# EasyEDA Pro project ProPrj_超级电容V1.1-正式版.epro, schematic Schematic1, sheets 4 to 8 of 8

## Sheets
4 功率控制: Page Name: 功率控制; Update Date: 2024-04-19
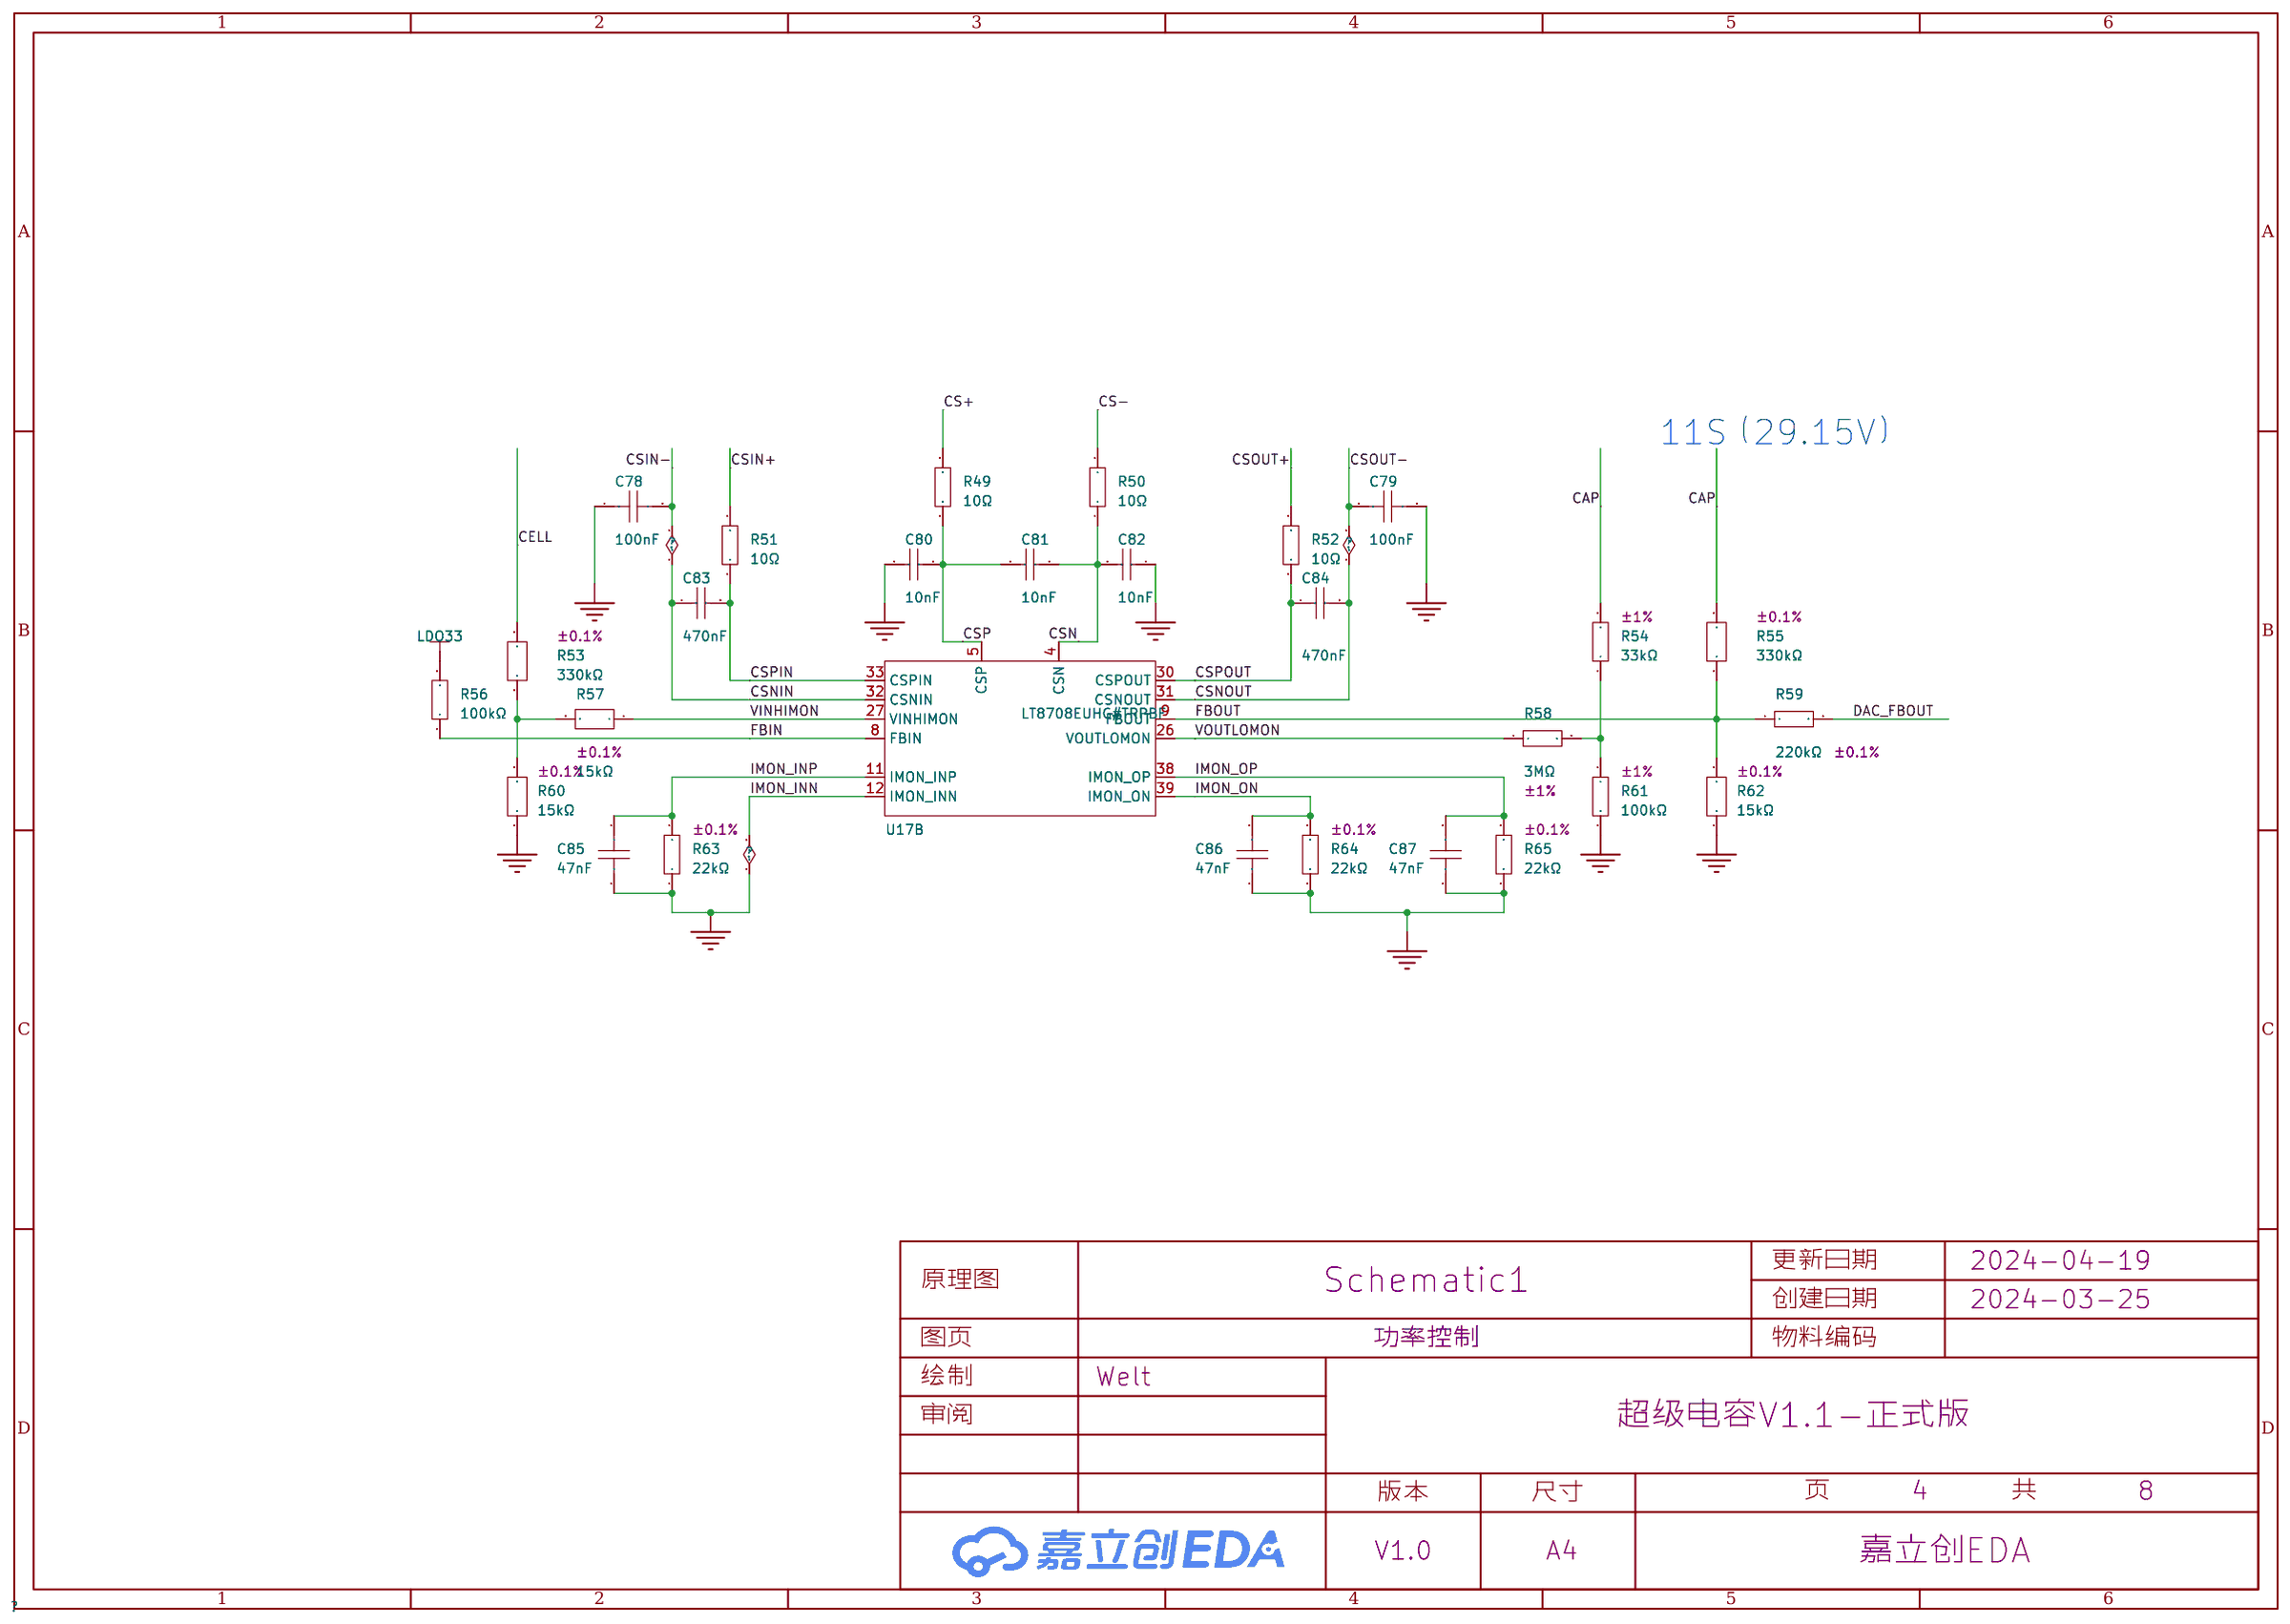
[diagram p3: 功率控制]
5 采样: Page Name: 采样; Update Date: 2024-04-19
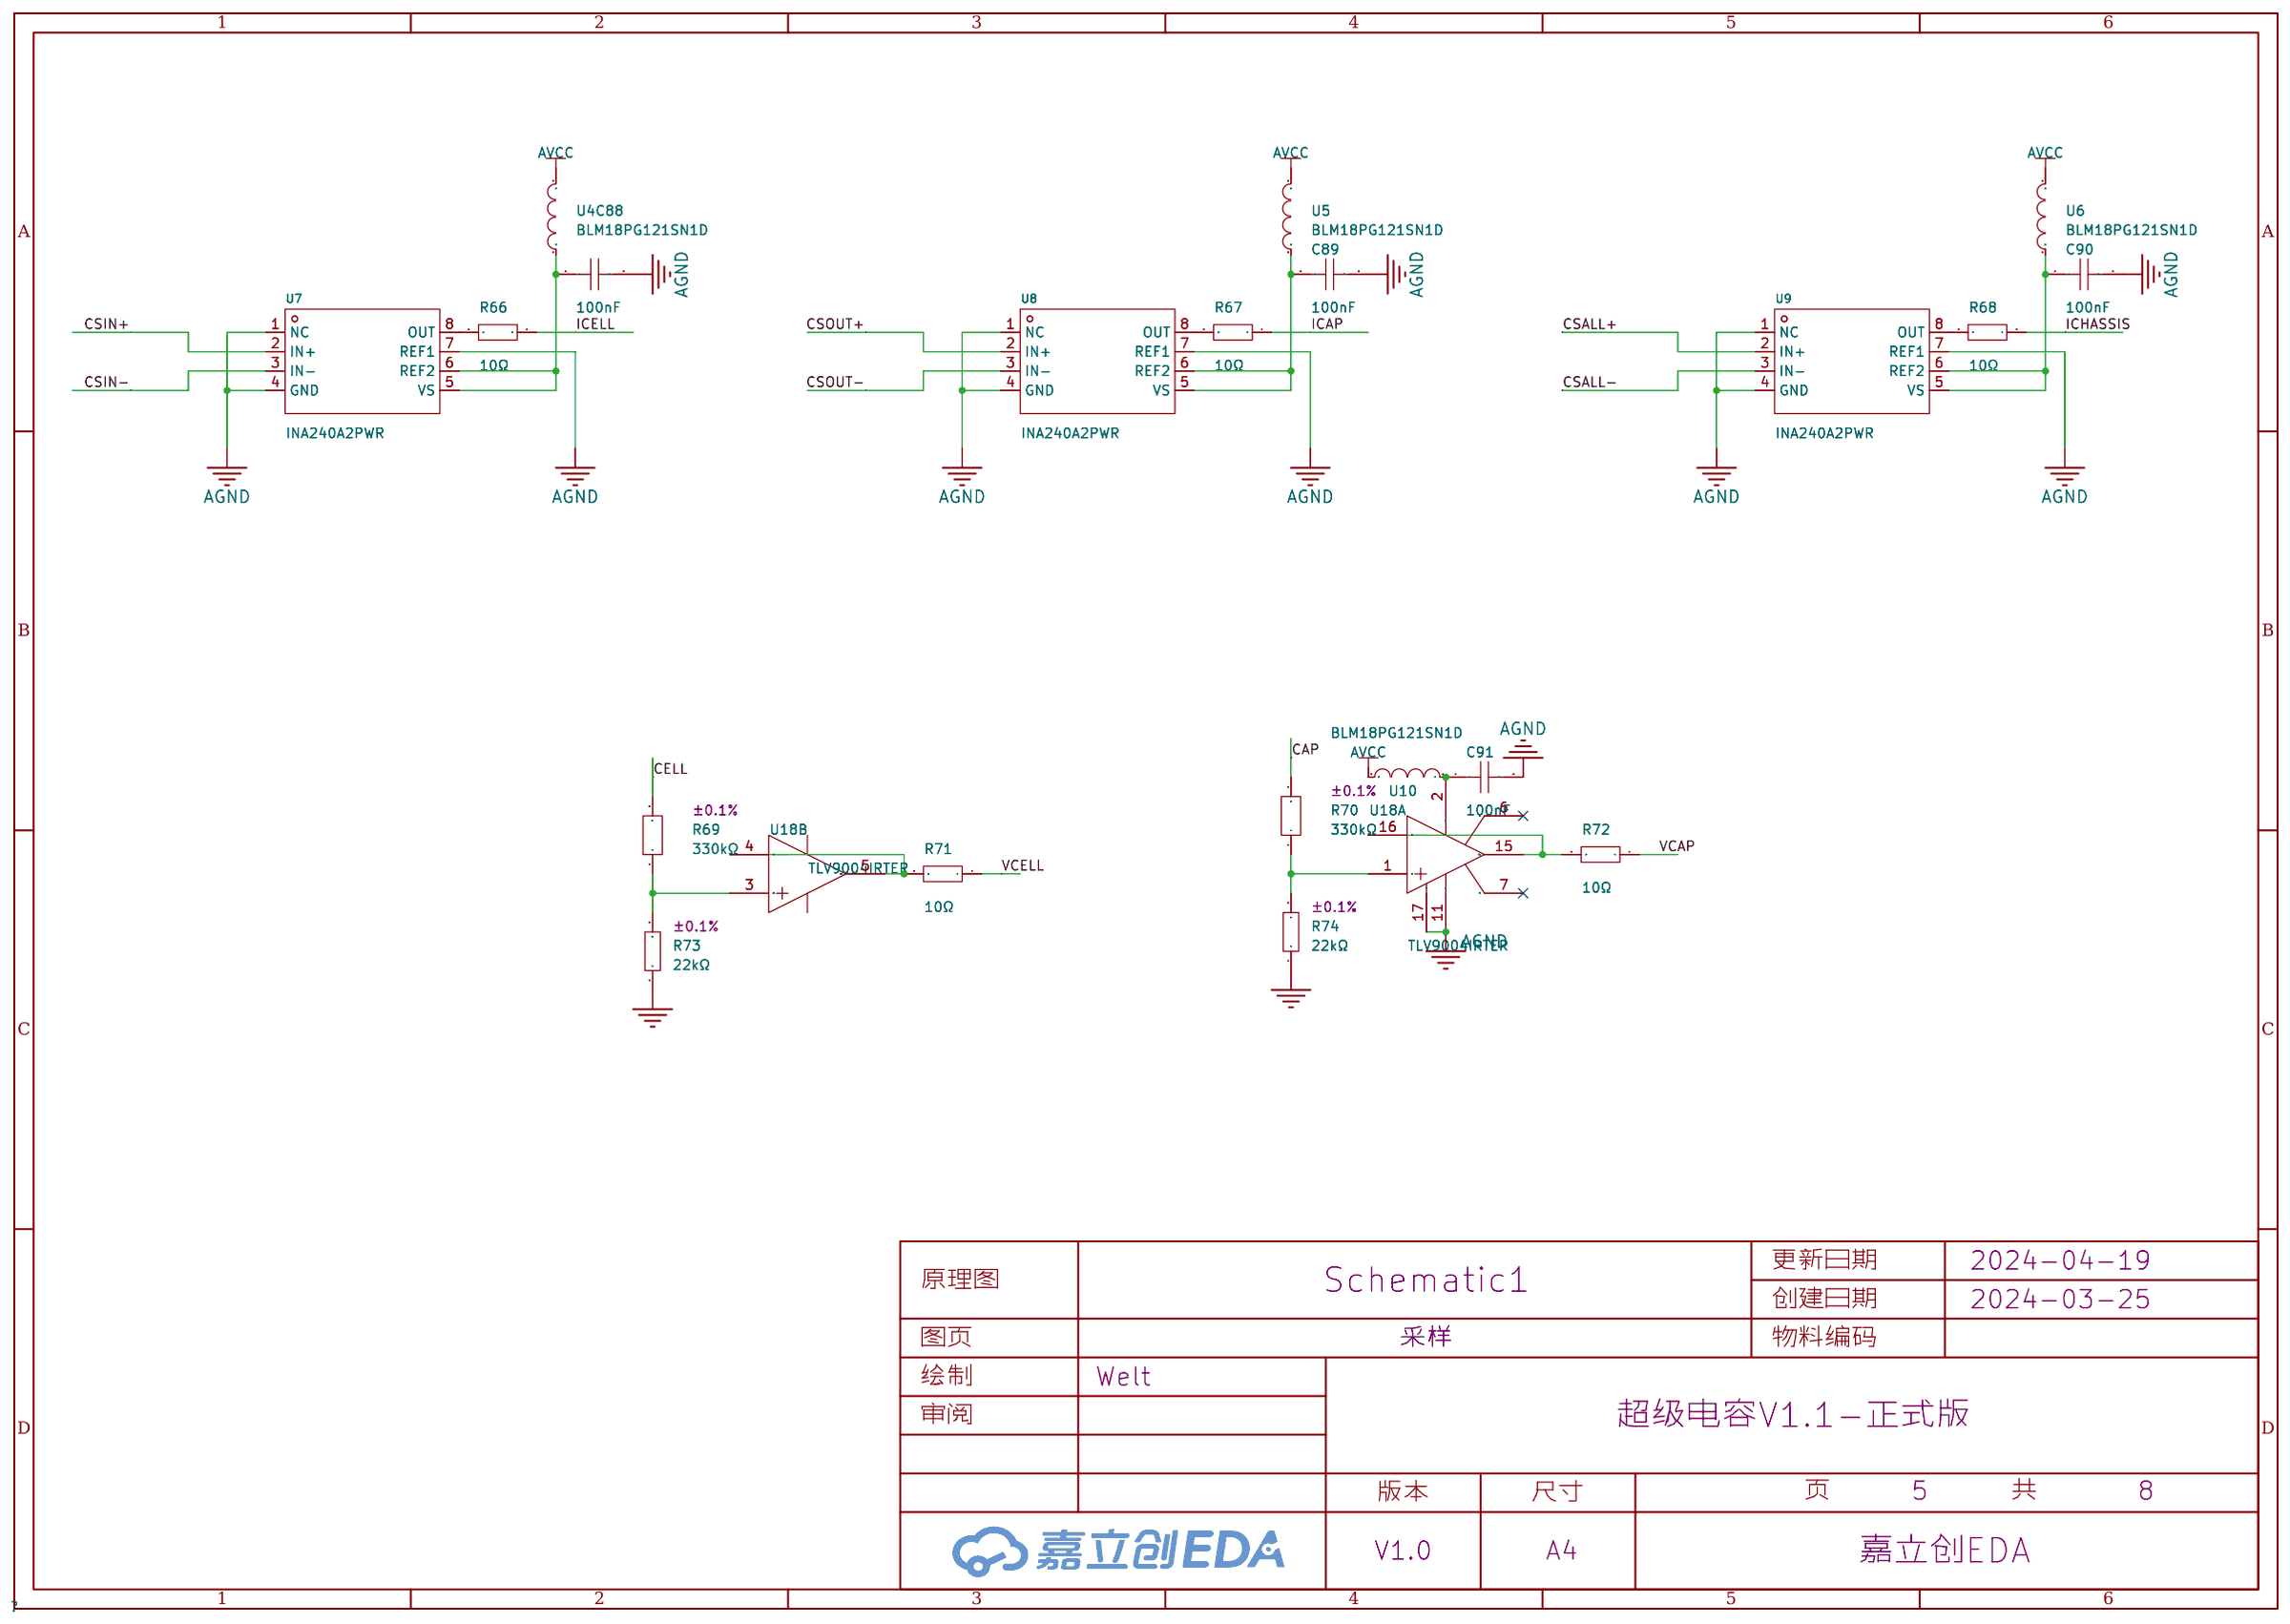
[diagram p4: 采样]
6 DAC: Page Name: DAC; Project Name: 超级电容V1.0-样板; Update Date: 2024-04-19
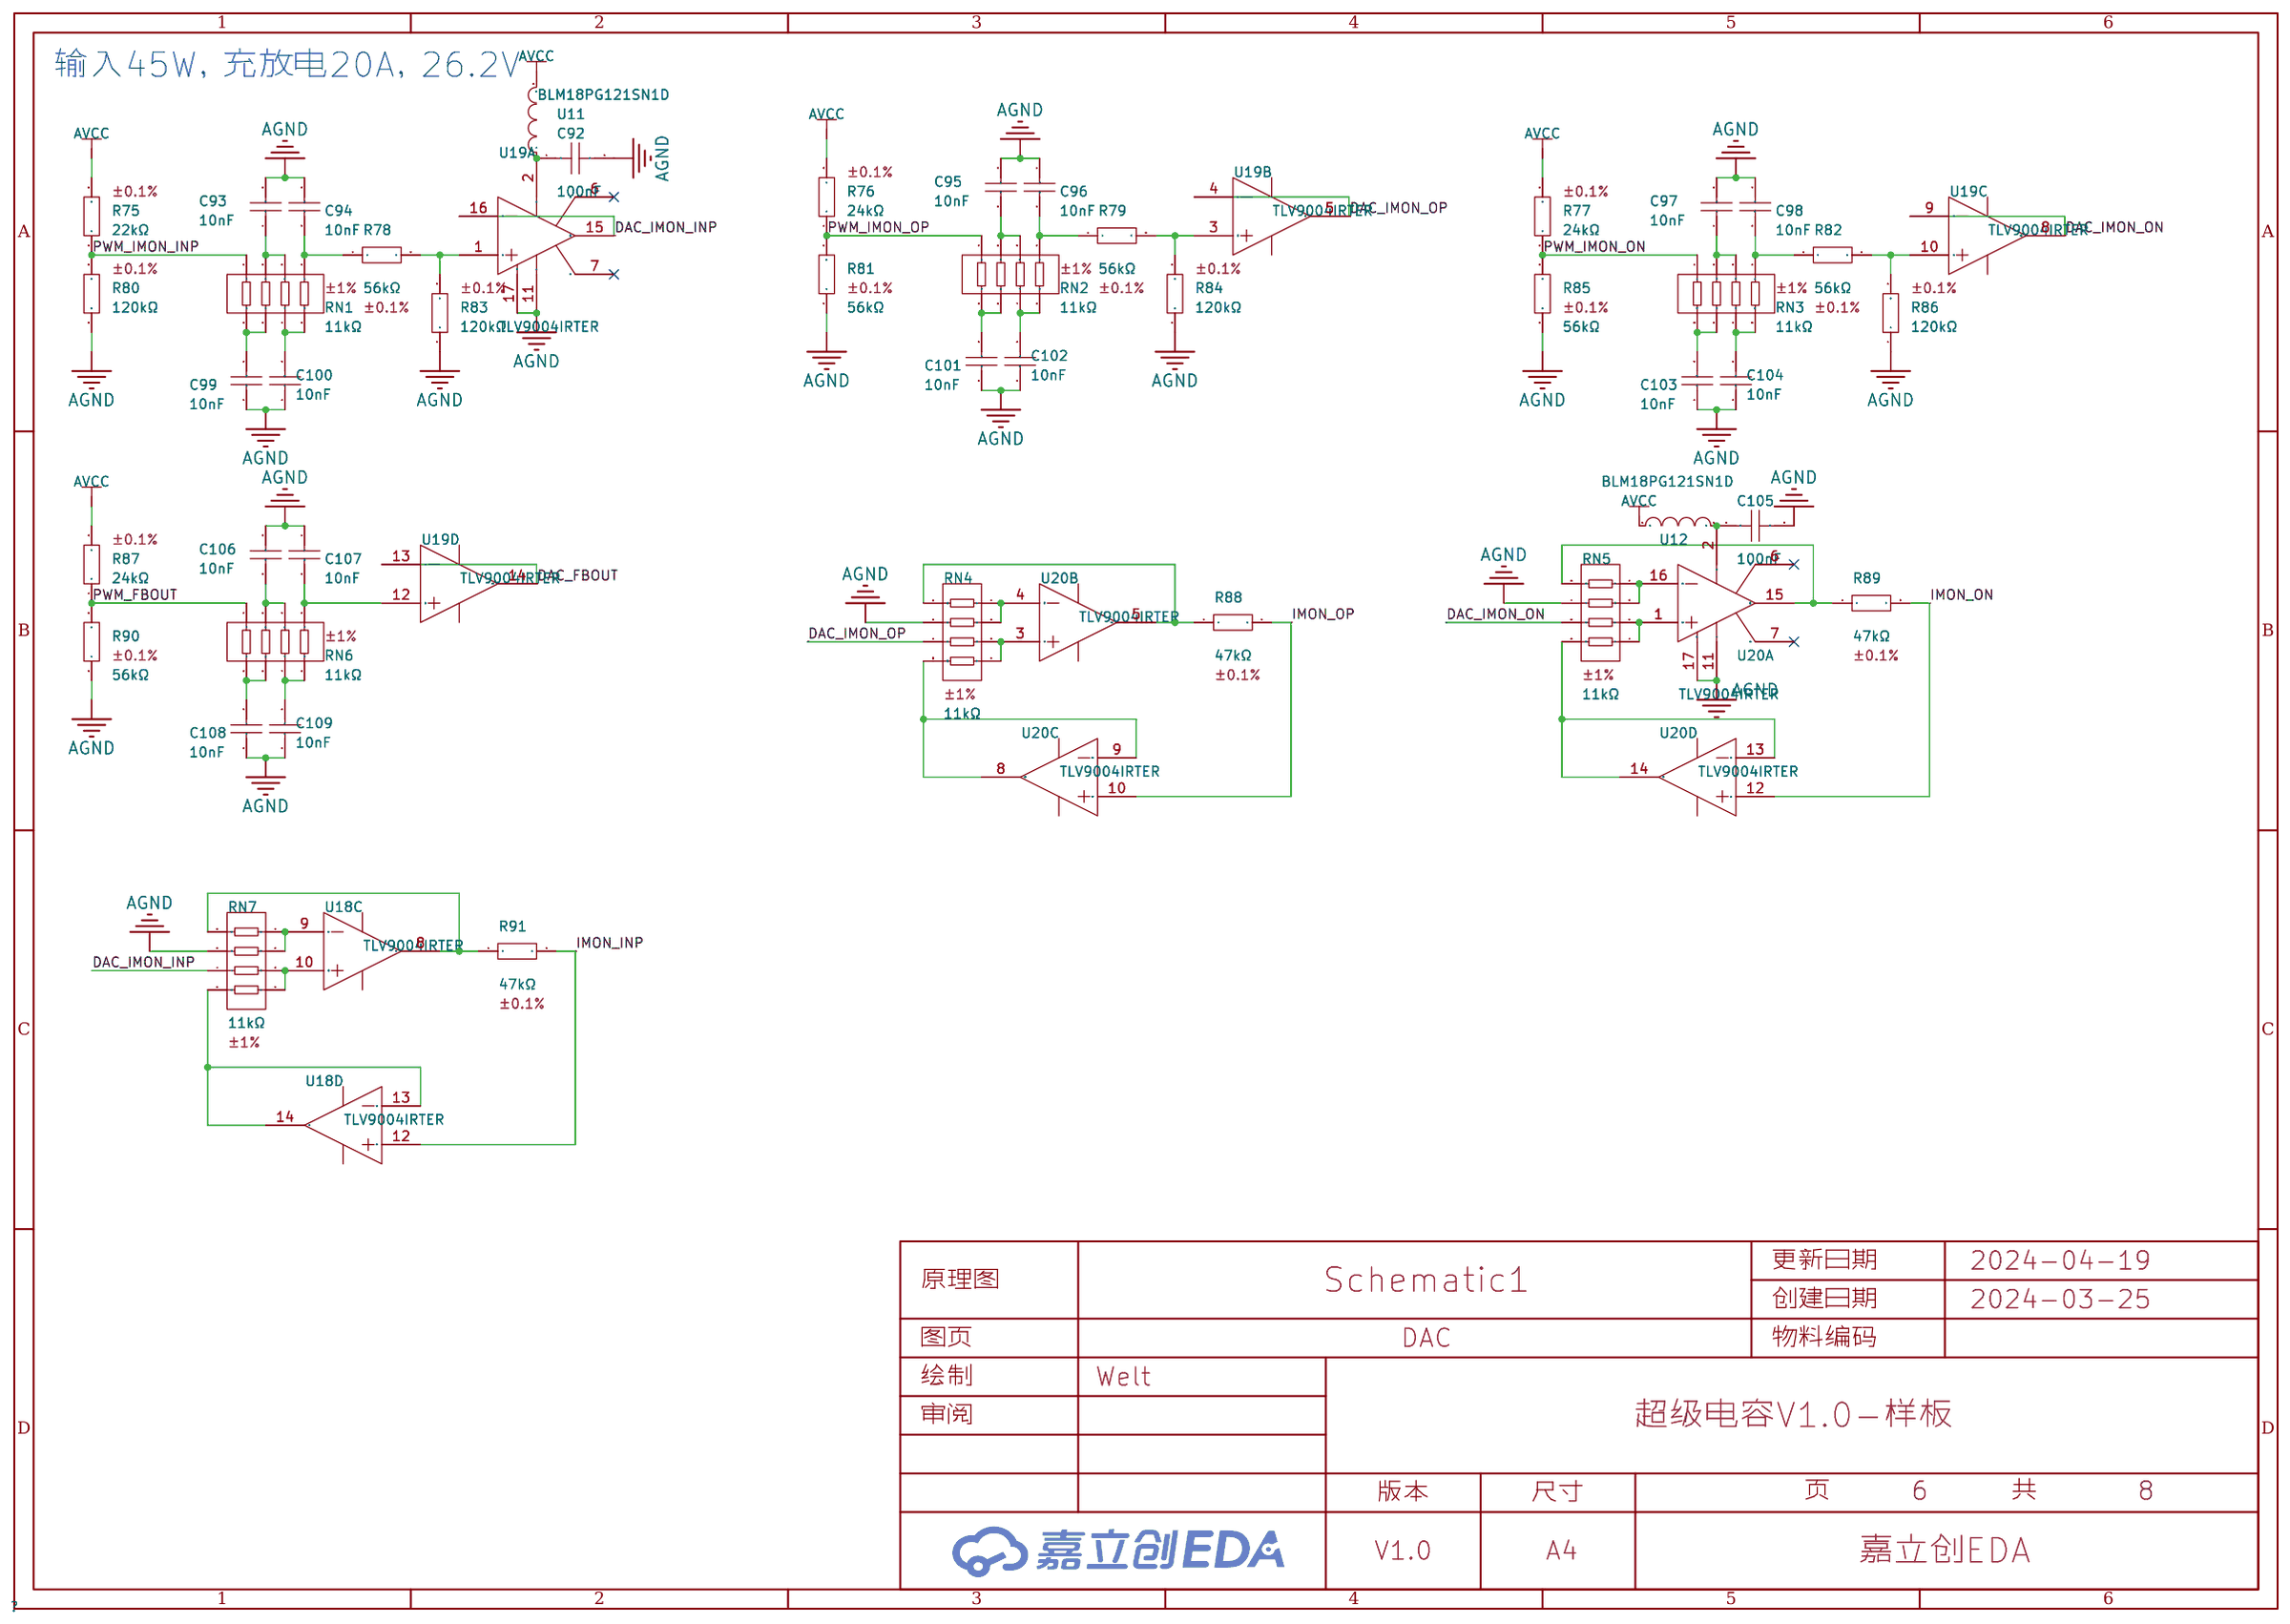
[diagram p5: DAC]
7 数字区: Page Name: 数字区; Project Name: 超级电容V1.0-样板
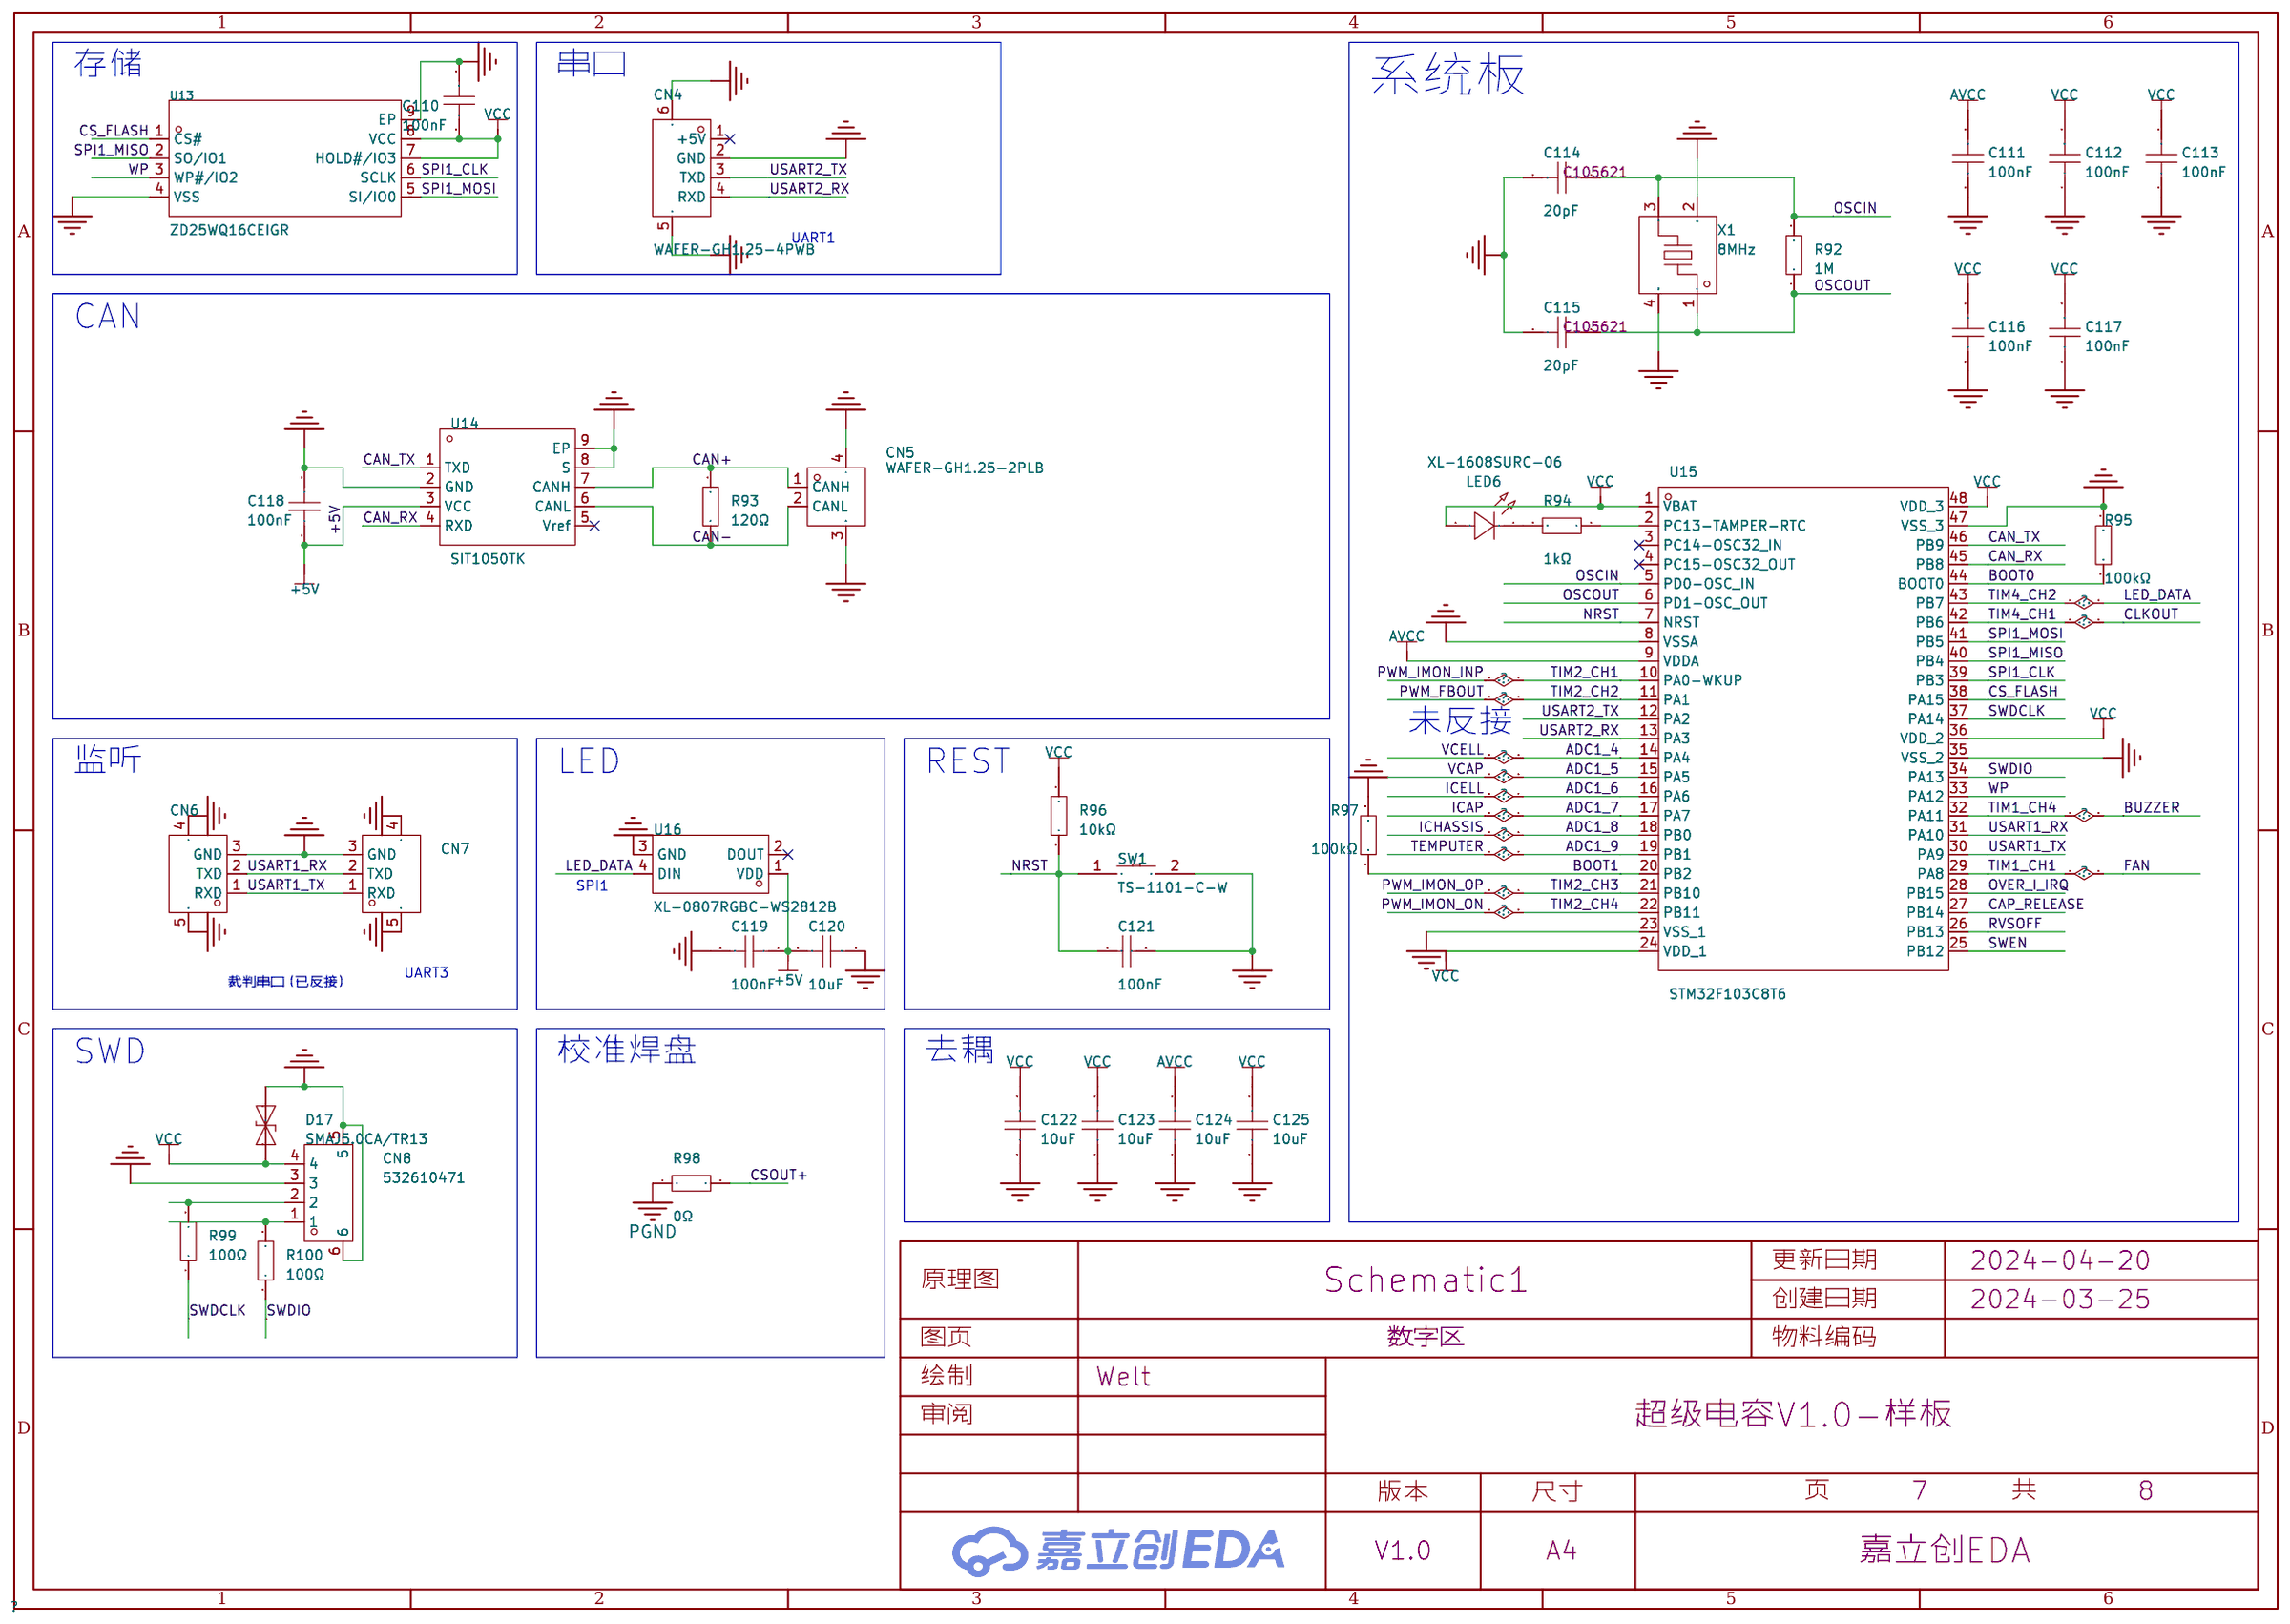
[diagram p6: 数字区]
8 保护: Page Name: 保护; Update Date: 2024-04-24
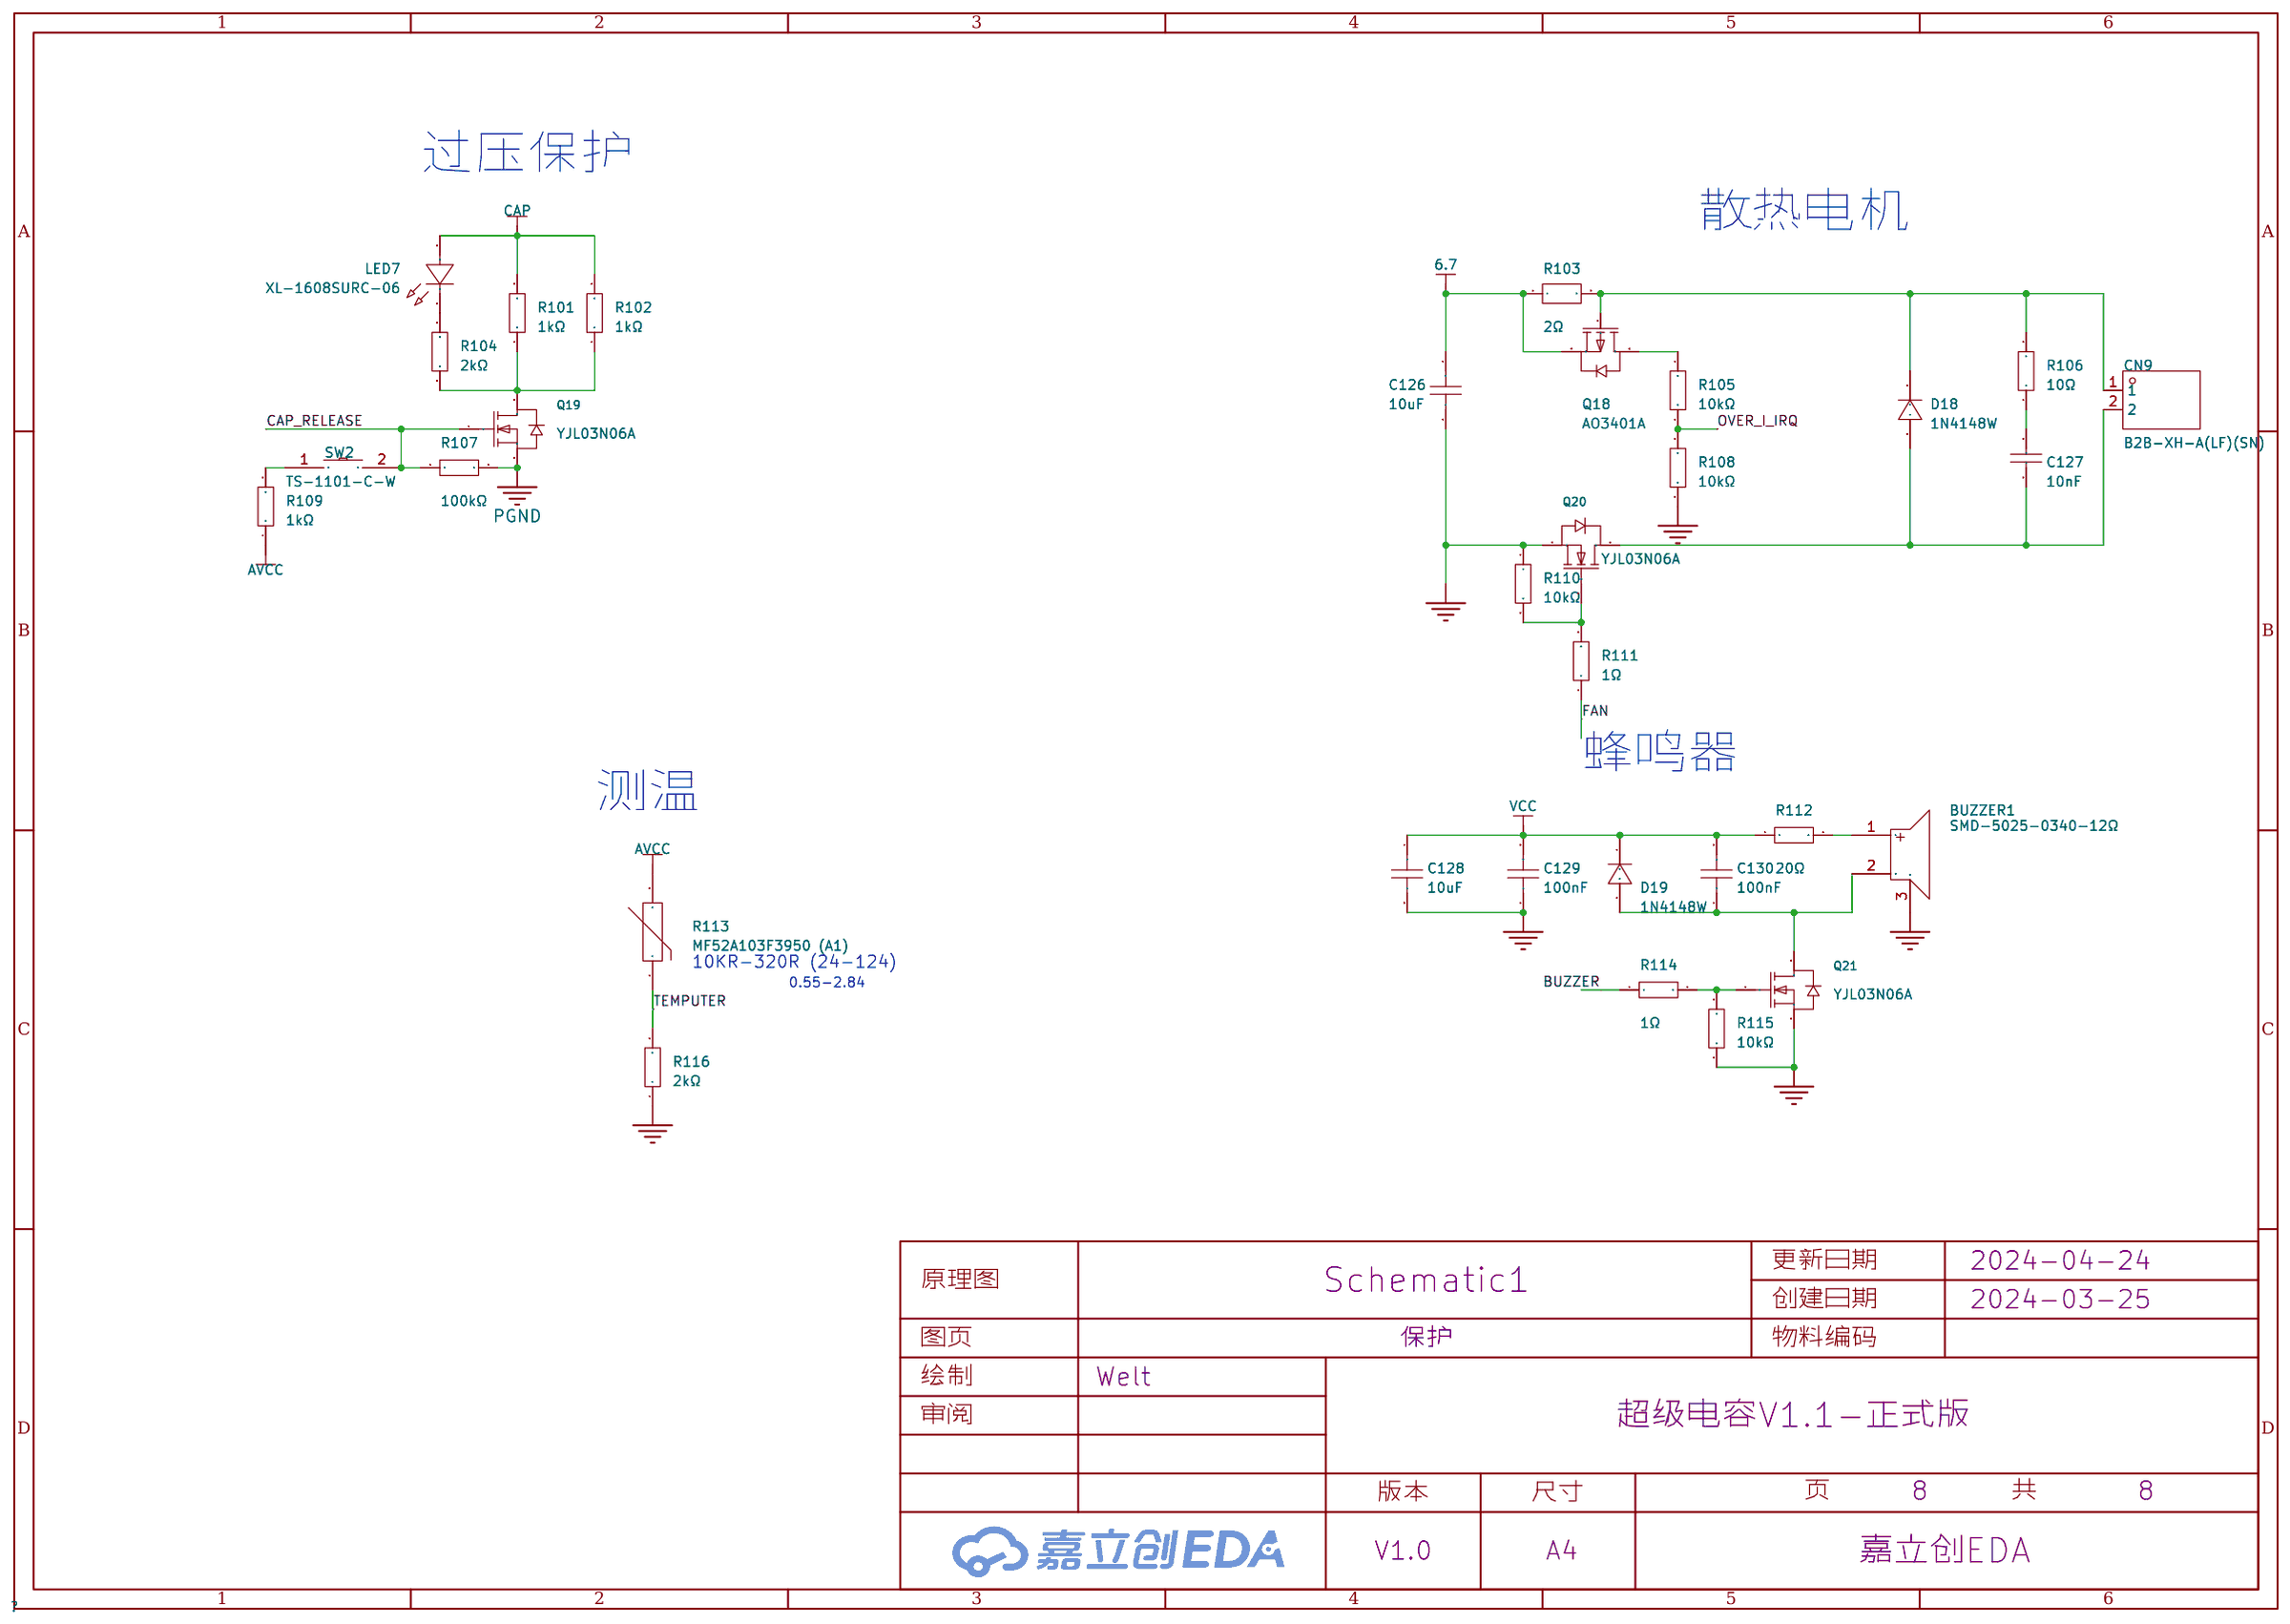
[diagram p7: 保护]

## Parts
sheet 8708核心区
U17  LT8708EUHG#TRPBF  [QFN-40_LT8708_Test]  (sections Center,Control,Power)
sheet DAC
C92  100nF  [0603电容-简化]
C93  10nF  [0603电容-简化]
C94  10nF  [0603电容-简化]
C95  10nF  [0603电容-简化]
C96  10nF  [0603电容-简化]
C97  10nF  [0603电容-简化]
C98  10nF  [0603电容-简化]
C99  10nF  [0603电容-简化]
C100  10nF  [0603电容-简化]
C101  10nF  [0603电容-简化]
C102  10nF  [0603电容-简化]
C103  10nF  [0603电容-简化]
C104  10nF  [0603电容-简化]
C105  100nF  [0603电容-简化]
C106  10nF  [0603电容-简化]
C107  10nF  [0603电容-简化]
C108  10nF  [0603电容-简化]
C109  10nF  [0603电容-简化]
R75  22kΩ  [0603电阻-简化]
R76  24kΩ  [0603电阻-简化]
R77  24kΩ  [0603电阻-简化]
R78  56kΩ  [0603电阻-简化]
R79  56kΩ  [0603电阻-简化]
R80  120kΩ  [0603电阻-简化]
R81  56kΩ  [0603电阻-简化]
R82  56kΩ  [0603电阻-简化]
R83  120kΩ  [0603电阻-简化]
R84  120kΩ  [0603电阻-简化]
R85  56kΩ  [0603电阻-简化]
R86  120kΩ  [0603电阻-简化]
R87  24kΩ  [0603电阻-简化]
R88  47kΩ  [0603电阻-简化]
R89  47kΩ  [0603电阻-简化]
R90  56kΩ  [0603电阻-简化]
R91  47kΩ  [0603电阻-简化]
RN1  11kΩ  [RES-ARRAY-SMD_0603-8P-L3.2-W1.6-BL]
RN2  11kΩ  [RES-ARRAY-SMD_0603-8P-L3.2-W1.6-BL]
RN3  11kΩ  [RES-ARRAY-SMD_0603-8P-L3.2-W1.6-BL]
RN4  11kΩ  [RES-ARRAY-SMD_0603-8P-L3.2-W1.6-BL]
RN5  11kΩ  [RES-ARRAY-SMD_0603-8P-L3.2-W1.6-BL]
RN6  11kΩ  [RES-ARRAY-SMD_0603-8P-L3.2-W1.6-BL]
RN7  11kΩ  [RES-ARRAY-SMD_0603-8P-L3.2-W1.6-BL]
U11  BLM18PG121SN1D  [0603磁珠-简化]
U12  BLM18PG121SN1D  [0603磁珠-简化]
U19  TLV9004IRTER  [WQFN-16_L3.0-W3.0-P0.50-TL-EP1.7]  (sections 1,2,3,4)
U20  TLV9004IRTER  [WQFN-16_L3.0-W3.0-P0.50-TL-EP1.7]  (sections 1,2,3,4)
sheet 保护
BUZZER1  SMD-5025-0340-12Ω  [BUZ-SMD_3P-L5.0-W5.0-BL]
C126  10uF  [0805电容-简化]
C127  10nF  [0603电容-简化]
C128  10uF  [0805电容-简化]
C129  100nF  [0603电容-简化]
C130  100nF  [0603电容-简化]
CN9  B2B-XH-A(LF)(SN)  [CONN-TH_B2B-XH-A-LF-SN]
D18  1N4148W  [SOD-123_L2.8-W1.8-LS3.7-RD]
D19  1N4148W  [SOD-123_L2.8-W1.8-LS3.7-RD]
LED7  XL-1608SURC-06  [LED0603-RD_RED]
Q18  AO3401A  [SOT-23_L2.9-W1.3-P1.90-LS2.4-BR]
Q19  YJL03N06A  [SOT-23-3_L2.9-W1.3-P1.90-LS2.4-BR]
Q20  YJL03N06A  [SOT-23-3_L2.9-W1.3-P1.90-LS2.4-BR]
Q21  YJL03N06A  [SOT-23-3_L2.9-W1.3-P1.90-LS2.4-BR]
R101  1kΩ  [R2512]
R102  1kΩ  [R2512]
R103  2Ω  [R2512]
R104  2kΩ  [0603电阻-简化]
R105  10kΩ  [0603电阻-简化]
R106  10Ω  [0603电阻-简化]
R107  100kΩ  [0603电阻-简化]
R108  10kΩ  [0603电阻-简化]
R109  1kΩ  [0603电阻-简化]
R110  10kΩ  [0603电阻-简化]
R111  1Ω  [0603电阻-简化]
R112  20Ω  [0603电阻-简化]
R113  MF52A103F3950 (A1)  [RES-TH_L2.5-W2.5-P1.70-D0.3]
R114  1Ω  [0603电阻-简化]
R115  10kΩ  [0603电阻-简化]
R116  2kΩ  [0603电阻-简化]
SW2  TS-1101-C-W  [SW-SMD_L6.0-W3.3-LS8.0]
sheet 功率控制
C78  100nF  [0603电容-简化]
C79  100nF  [0603电容-简化]
C80  10nF  [0603电容-简化]
C81  10nF  [0603电容-简化]
C82  10nF  [0603电容-简化]
C83  470nF  [0603电容-简化]
C84  470nF  [0603电容-简化]
C85  47nF  [0603电容-简化]
C86  47nF  [0603电容-简化]
C87  47nF  [0603电容-简化]
R49  10Ω  [0603电阻-简化]
R50  10Ω  [0603电阻-简化]
R51  10Ω  [0603电阻-简化]
R52  10Ω  [0603电阻-简化]
R53  330kΩ  [0603电阻-简化]
R54  33kΩ  [0603电阻-简化]
R55  330kΩ  [0603电阻-简化]
R56  100kΩ  [0603电阻-简化]
R57  15kΩ  [0603电阻-简化]
R58  3MΩ  [0603电阻-简化]
R59  220kΩ  [0603电阻-简化]
R60  15kΩ  [0603电阻-简化]
R61  100kΩ  [0603电阻-简化]
R62  15kΩ  [0603电阻-简化]
R63  22kΩ  [0603电阻-简化]
R64  22kΩ  [0603电阻-简化]
R65  22kΩ  [0603电阻-简化]
sheet 数字区
C110  100nF  [0603电容-简化]
C111  100nF  [0603电容-简化]
C112  100nF  [0603电容-简化]
C113  100nF  [0603电容-简化]
C114  20pF  [0603电容-简化]
C115  20pF  [0603电容-简化]
C116  100nF  [0603电容-简化]
C117  100nF  [0603电容-简化]
C118  100nF  [0603电容-简化]
C119  100nF  [0603电容-简化]
C120  10uF  [0805电容-简化]
C121  100nF  [0603电容-简化]
C122  10uF  [0805电容-简化]
C123  10uF  [0805电容-简化]
C124  10uF  [0805电容-简化]
C125  10uF  [0805电容-简化]
CN4  WAFER-GH1.25-4PWB  [CONN-SMD_4P-P1.25_XUNPU_WAFER-GH1.25-4PWB]
CN5  WAFER-GH1.25-2PLB  [CONN-TH_2P-P1.25_XUNPU_WAFER-GH1.25-2PLB]
CN6  WAFER-GH1.25-3PLB  [CONN-SMD_3P-P1.25_XUNPU_WAFER-GH1.25-3PLB]
CN7  WAFER-GH1.25-3PLB  [CONN-SMD_3P-P1.25_XUNPU_WAFER-GH1.25-3PLB]
CN8  532610471  [CONN-SMD_4P-P1.25_53261-0471]
D17  SMAJ5.0CA/TR13  [SMA_L4.4-W2.6-LS5.0-BI]
LED6  XL-1608SURC-06  [LED0603-RD_RED]
R92  1M  [0603电阻-简化]
R93  120Ω  [0603电阻-简化]
R94  1kΩ  [0603电阻-简化]
R95  100kΩ  [0603电阻-简化]
R96  10kΩ  [0603电阻-简化]
R97  100kΩ  [0603电阻-简化]
R98  0Ω  [R0402]
R99  100Ω  [0603电阻-简化]
R100  100Ω  [0603电阻-简化]
SW1  TS-1101-C-W  [SW-SMD_L6.0-W3.3-LS8.0]
U13  ZD25WQ16CEIGR  [USON-8_L3.0-W2.0-P0.50-BL-EP]
U14  SIT1050TK  [TDFN-8_L3.0-W3.0-P0.65-BL-EP]
U15  STM32F103C8T6  [LQFP-48_L7.0-W7.0-P0.50-LS9.0-BL]
U16  XL-0807RGBC-WS2812B  [LED-SMD_4P-L2.0-W1.8_CY-0807]
X1  8MHz  [CRYSTAL-SMD_4P-L3.2-W2.5-BL-1]
sheet 采样
C88  100nF  [0603电容-简化]
C89  100nF  [0603电容-简化]
C90  100nF  [0603电容-简化]
C91  100nF  [0603电容-简化]
R66  10Ω  [0603电阻-简化]
R67  10Ω  [0603电阻-简化]
R68  10Ω  [0603电阻-简化]
R69  330kΩ  [0603电阻-简化]
R70  330kΩ  [0603电阻-简化]
R71  10Ω  [0603电阻-简化]
R72  10Ω  [0603电阻-简化]
R73  22kΩ  [0603电阻-简化]
R74  22kΩ  [0603电阻-简化]
U4  BLM18PG121SN1D  [0603磁珠-简化]
U5  BLM18PG121SN1D  [0603磁珠-简化]
U6  BLM18PG121SN1D  [0603磁珠-简化]
U7  INA240A2PWR  [TSSOP-8_L4.4-W3.0-P0.65-LS6.4-BL]
U8  INA240A2PWR  [TSSOP-8_L4.4-W3.0-P0.65-LS6.4-BL]
U9  INA240A2PWR  [TSSOP-8_L4.4-W3.0-P0.65-LS6.4-BL]
U10  BLM18PG121SN1D  [0603磁珠-简化]
U18  TLV9004IRTER  [WQFN-16_L3.0-W3.0-P0.50-TL-EP1.7]  (sections 1,2,3,4)

## Library data of the parts
U17 = LT8708EUHG#TRPBF: 功能类型:升降压型;同步整流:是;输出通道数:1;拓扑结构:升降压式;输入电压:2.8V~80V;开关频率:400kHz;占空比(最大值):80%;工作温度:-40℃~+125℃;; LCSC Part Name: 升降压型 2.8V~80V 400kHz; Supplier Part: C2658801; Manufacturer: ADI(亚德诺)/LINEAR; Supplier Footprint: QFN-40(5x8); JLCPCB Part Class: 扩展库; Datasheet: https://atta.szlcsc.com/upload/public/pdf/source/20210601/0A4036ACA6D5292E858C905D6C703EE3.pdf; Supplier: LCSC; Function: 升降压型; Synchronous Rectification: 是; Number of Outputs: 1; Topology: 升降压式; Input Voltage: 2.8V~80V; Switching Frequency: 400kHz; Duty Cycle (Max): 80%; Operating Temperature: -40℃~+125℃; Check: false
C78 C79 C88-C92 C105 C129 C130 = CC0603KRX7R9BB104: 容值:100nF;精度:±10%;额定电压:50V;材质(温度系数):X7R;; LCSC Part Name: 100nF ±10% 50V; Supplier Part: C14663; Manufacturer: YAGEO(国巨); Supplier Footprint: 0603; JLCPCB Part Class: 基础库; Datasheet: https://atta.szlcsc.com/upload/public/pdf/source/20180910/C282072_33301C7F631E79921B82A8DAC6BCC5B3.pdf; Supplier: LCSC; Tolerance: ±10%; Voltage Rated: 50V; Temperature Coefficient: X7R
C80-C82 C93-C104 C106-C109 C127 = CC0603KRX7R9BB103: 容值:10nF;精度:±10%;额定电压:50V;材质(温度系数):X7R;; LCSC Part Name: 10nF ±10% 50V; Supplier Part: C100042; Manufacturer: YAGEO(国巨); Supplier Footprint: 0603; JLCPCB Part Class: 扩展库; Datasheet: https://atta.szlcsc.com/upload/public/pdf/source/20180326/C100042_E8B0111D51DE3671A0A4A59FBCEFE81C.pdf; Supplier: LCSC; Tolerance: ±10%; Voltage Rated: 50V; Temperature Coefficient: X7R
R63-R65 R73-R75 = PTFR0603B22K0P9: 电阻类型:薄膜电阻;阻值:22kΩ;精度:±0.1%;功率:100mW;最大工作电压:100V;温度系数:±25ppm/℃;; LCSC Part Name: 薄膜电阻 22kΩ ±0.1% 100mW; Supplier Part: C351665; Manufacturer: RESI(开步睿思）; Supplier Footprint: 0603; JLCPCB Part Class: Extended Part; Datasheet: https://atta.szlcsc.com/upload/public/pdf/source/20231020/37F75D505DFC5CA75CC16B0F0ECD8764.pdf; Supplier: LCSC; Type: 薄膜电阻; Tolerance: ±0.1%; Power(Watts): 100mW; Overload Voltage (Max): 100V; Temperature Coefficient: ±25ppm/℃; Operating Temperature Range: -55℃~+125℃
R76 R77 R87 = PTFR0603B24K0P9: 电阻类型:薄膜电阻;阻值:24kΩ;精度:±0.1%;功率:100mW;最大工作电压:100V;温度系数:±25ppm/℃;; LCSC Part Name: 薄膜电阻 24kΩ ±0.1% 100mW; Supplier Part: C351663; Manufacturer: RESI(开步睿思）; Supplier Footprint: 0603; JLCPCB Part Class: Extended Part; Datasheet: https://atta.szlcsc.com/upload/public/pdf/source/20231020/37F75D505DFC5CA75CC16B0F0ECD8764.pdf; Supplier: LCSC; Type: 薄膜电阻; Tolerance: ±0.1%; Power(Watts): 100mW; Overload Voltage (Max): 100V; Temperature Coefficient: ±25ppm/℃; Operating Temperature Range: -55℃~+125℃
R78 R79 R81 R82 R85 R90 = PTFR0603B56K0P9: 电阻类型:薄膜电阻;阻值:56kΩ;精度:±0.1%;功率:100mW;最大工作电压:100V;温度系数:±25ppm/℃;; LCSC Part Name: 薄膜电阻 56kΩ ±0.1% 100mW; Supplier Part: C351640; Manufacturer: RESI(开步睿思）; Supplier Footprint: 0603; JLCPCB Part Class: Extended Part; Datasheet: https://atta.szlcsc.com/upload/public/pdf/source/20231020/37F75D505DFC5CA75CC16B0F0ECD8764.pdf; Supplier: LCSC; Type: 薄膜电阻; Tolerance: ±0.1%; Power(Watts): 100mW; Overload Voltage (Max): 100V; Temperature Coefficient: ±25ppm/℃; Operating Temperature Range: -55℃~+125℃
R80 R83 R84 R86 = PTFR0603B120KP9: 电阻类型:薄膜电阻;阻值:120kΩ;精度:±0.1%;功率:100mW;最大工作电压:100V;温度系数:±25ppm/℃;; LCSC Part Name: 薄膜电阻 120kΩ ±0.1% 100mW; Supplier Part: C351687; Manufacturer: RESI(开步睿思）; Supplier Footprint: 0603; JLCPCB Part Class: Extended Part; Datasheet: https://atta.szlcsc.com/upload/public/pdf/source/20231020/37F75D505DFC5CA75CC16B0F0ECD8764.pdf; Supplier: LCSC; Type: 薄膜电阻; Tolerance: ±0.1%; Power(Watts): 100mW; Overload Voltage (Max): 100V; Temperature Coefficient: ±25ppm/℃; Operating Temperature Range: -55℃~+125℃
R88 R89 R91 = PTFR0603B47K0P9: 电阻类型:薄膜电阻;阻值:47kΩ;精度:±0.1%;功率:100mW;最大工作电压:100V;温度系数:±25ppm/℃;; LCSC Part Name: 薄膜电阻 47kΩ ±0.1% 100mW; Supplier Part: C328427; Manufacturer: RESI(开步睿思）; Supplier Footprint: 0603; JLCPCB Part Class: Extended Part; Datasheet: https://atta.szlcsc.com/upload/public/pdf/source/20231020/37F75D505DFC5CA75CC16B0F0ECD8764.pdf; Supplier: LCSC; Type: 薄膜电阻; Tolerance: ±0.1%; Power(Watts): 100mW; Overload Voltage (Max): 100V; Temperature Coefficient: ±25ppm/℃; Operating Temperature Range: -55℃~+125℃
RN1-RN7 = 4D03WGF1102T5E: 阻值:11kΩ;精度:±1%;单个元件功率:62.5mW;电阻器数:4;温度系数:±200ppm/℃;; LCSC Part Name: 11kΩ ±1%; Supplier Part: C425236; Manufacturer: UNI-ROYAL(厚声); Supplier Footprint: 0603x4; JLCPCB Part Class: Extended Part; Datasheet: https://atta.szlcsc.com/upload/public/pdf/source/20191224/C474318_2527498AE30E813171187CCD28401A71.pdf; Supplier: LCSC; Tolerance: ±1%; Power(Watts): 62.5mW; Number of Resistors: 4; Temperature Coefficient: ±200ppm/℃; Number of Pins: 8
U4-U6 U10-U12 = BLM18PG121SN1D: 标称阻抗@测试频率:120Ω@100MHz;误差:±25%;直流电阻(RDC):50mΩ;额定电流:2A;电路数:1;; LCSC Part Name: 120Ω@100MHz ±25%; Supplier Part: C14709; Manufacturer: muRata(村田); Supplier Footprint: 0603; JLCPCB Part Class: 扩展库; Datasheet: https://atta.szlcsc.com/upload/public/pdf/source/20130704/1457706621134.pdf; Supplier: LCSC; Impedance @ Frequency: 120Ω@100MHz; Tolerance: ±25%; DC Resistance: 50mΩ; Current Rating: 2A; Circuits: 1
U18-U20 = TLV9004IRTER: 放大器数:四路;增益带宽积(GBP):1MHz;输入偏置电流(Ib):5pA;压摆率(SR):2V/us;带宽(-3db):-;轨到轨:-;; Supplier Part: C2058260; Manufacturer: TI(德州仪器); Supplier Footprint: WQFN-16-EP(3x3); JLCPCB Part Class: 扩展库; Datasheet: https://www.ti.com/cn/lit/gpn/tlv9004; Supplier: LCSC; Number of Circuits: 四路; Gain Bandwidth Product(GBP): 1MHz; Current - Input Bias(Ib): 5pA; Slew Rate(SR): 2V/us; Output Current: 40mA; Operating Temperature: -40℃~+125℃
BUZZER1 = SMD-5025-0340-12Ω: LCSC Part Name: 贴片无源蜂鸣器; Supplier Part: C2693575; Manufacturer: SS(海旭); Supplier Footprint: SMD,5x5mm; JLCPCB Part Class: 扩展库; Datasheet: https://atta.szlcsc.com/upload/public/pdf/source/20210304/C2693575_C016F81F20CF44788ED1674423B845A2.pdf; Supplier: LCSC
C120 C122-C126 C128 = CL21A106KBYQNNE: 容值:10uF;精度:±10%;额定电压:50V;材质(温度系数):X5R;; LCSC Part Name: 10uF ±10% 50V; Supplier Part: C2932476; Manufacturer: SAMSUNG(三星); Supplier Footprint: 0805; JLCPCB Part Class: 扩展库; Datasheet: https://atta.szlcsc.com/upload/public/pdf/source/20211217/EA547804C3DC63CB0E92325AB8B6CF61.pdf; Supplier: LCSC; Tolerance: ±10%; Voltage Rated: 50V; Temperature Coefficient: X5R
CN9 = B2B-XH-A(LF)(SN): 参考系列:XH;间距:2.5mm;插针结构:1x2P;排数:1;每排PIN数:2;行距:-;安装方式:-;触头材质:黄铜;; LCSC Part Name: 系列:XH 间距:2.5mm 1x2P; Supplier Part: C158012; Manufacturer: JST; Supplier Footprint: 插件,P=2.5mm; JLCPCB Part Class: 扩展库; Datasheet: https://atta.szlcsc.com/upload/public/pdf/source/20180928/C265283_F9DFEEBDB2CF642B6BDFAB4B77BD2680.pdf; Supplier: LCSC; Reference Series: XH; Pitch: 2.5mm; Pins Structure: 1x2P; Number of Rows: 1; Number of PINs Per Row: 2; Contact Material: 黄铜
D18 D19 = 1N4148W_C2099: 二极管配置:独立式;功率:500mW;直流反向耐压(Vr):100V;平均整流电流(Io):150mA;正向压降(Vf):1.25V@150mA;反向电流(Ir):1uA@75V;反向恢复时间(trr):4ns;工作温度:+150℃@(Tj);; LCSC Part Name: 100V 150mA 4ns T4; Supplier Part: C2099; Manufacturer: CJ(江苏长电/长晶); Supplier Footprint: SOD-123; JLCPCB Part Class: 扩展库; Datasheet: https://atta.szlcsc.com/upload/public/pdf/source/20120428/1457706480199.pdf; Supplier: LCSC; Diode Configuration: 独立式; Power Dissipation: 500mW; Reverse Voltage (Vr): 100V; Average Rectified Current (Io): 150mA; Forward Voltage (Vf@If): 1.25V@150mA; Reverse Leakage Current: 1uA@75V; Reverse Recovery Time (trr): 4ns; Operating Temperature: +150℃@(Tj)
LED6 LED7 = XL-1608SURC-06: 发光颜色:红灯;主波长:617nm~621nm;色温:-;功率:55mW;安装方式:正贴;; LCSC Part Name: 红灯 正贴; Supplier Part: C965799; Manufacturer: XINGLIGHT(成兴光); Supplier Footprint: 0603; JLCPCB Part Class: 扩展库; Datasheet: https://atta.szlcsc.com/upload/public/pdf/source/20221102/D860AFDD1CDB02C5A8064103A32707E2.pdf; Supplier: LCSC; Emitted Color: 红灯; Lens Color: 无色透明; Dominant Wavelength: 617nm~621nm; Peak Wavelength: 623nm; Forward Current: 25mA; Power Dissipation: 55mW; Viewing Angle: 120°; Mounting Sytle: 正贴; Operating Temperature: -30℃~+85℃
Q18 = AO3401A_C347476: Supplier Part: C347476; Manufacturer: UMW(广东友台半导体); Supplier Footprint: SOT-23; JLCPCB Part Class: 扩展库; Datasheet: https://atta.szlcsc.com/upload/public/pdf/source/20190827/C347476_6CCC01FEC3E3D166C83BA0E415FD2056.pdf; Supplier: LCSC
Q19-Q21 = YJL03N06A: 类型:N沟道;漏源电压(Vdss):60V;连续漏极电流(Id):3A;功率(Pd):1.2W;导通电阻(RDS(on)@Vgs,Id):86mΩ@10V,3A;; LCSC Part Name: N沟道 60V 3A; Supplier Part: C699294; Manufacturer: YANGJIE(扬杰); Supplier Footprint: SOT-23-3L; JLCPCB Part Class: 扩展库; Supplier: LCSC; Type: N沟道; Drain Source Voltage (Vdss): 60V; Continuous Drain Current (Id): 3A; Power Dissipation (Pd): 1.2W; Drain Source On Resistance (RDS(on)@Vgs,Id): 86mΩ@10V,3A; Gate Threshold Voltage (Vgs(th)@Id): 1.3V@250uA; Total Gate Charge (Qg@Vgs): 5.1nC@10V; Input Capacitance (Ciss@Vds): 330pF@30V; Reverse Transfer Capacitance (Crss@Vds): 17pF@30V; Operating Temperature: -55℃~+150℃@(Tj)
R101 R102 = 25121WJ0102T4E: 阻值:1kΩ;精度:±5%;功率:1W;温度系数:±100ppm/℃;电阻类型:厚膜电阻;; LCSC Part Name: 1kΩ ±5% 1W 厚膜电阻; Supplier Part: C31885; Manufacturer: UNI-ROYAL(厚声); Supplier Footprint: 2512; JLCPCB Part Class: Extended Part; Datasheet: https://atta.szlcsc.com/upload/public/pdf/source/20200306/C422600_1E6D84923E4A46A82E41ADD87F860B5C.pdf; Supplier: LCSC; Tolerance: ±5%; Power(Watts): 1W; Overload Voltage (Max): 200V; Temperature Coefficient: ±100ppm/℃; Type: 厚膜电阻; Operating Temperature Range: -55℃~+155℃
R103 = RPL-12L2R00FT: 电阻类型:厚膜电阻;阻值:2Ω;精度:±1%;功率:2W;温度系数:±250ppm/℃;; LCSC Part Name: 厚膜电阻 2Ω ±1% 2W; Supplier Part: C5119990; Manufacturer: FH(风华); Supplier Footprint: 2512; JLCPCB Part Class: Extended Part; Datasheet: https://atta.szlcsc.com/upload/public/pdf/source/20220725/25754A1098DC500963809B9761B968C9.pdf; Supplier: LCSC; Type: 厚膜电阻; Tolerance: ±1%; Power(Watts): 2W; Temperature Coefficient: ±250ppm/℃
R104 R116 = 0603WAF2001T5E: 阻值:2kΩ;精度:±1%;功率:100mW;温度系数:±100ppm/℃;电阻类型:厚膜电阻;; LCSC Part Name: 2kΩ ±1% 100mW 厚膜电阻; Supplier Part: C22975; Manufacturer: UNI-ROYAL(厚声); Supplier Footprint: 0603; JLCPCB Part Class: Basic Part; Datasheet: https://atta.szlcsc.com/upload/public/pdf/source/20200306/C422600_1E6D84923E4A46A82E41ADD87F860B5C.pdf; Supplier: LCSC; Tolerance: ±1%; Power(Watts): 100mW; Overload Voltage (Max): 75V; Temperature Coefficient: ±100ppm/℃; Type: 厚膜电阻; Operating Temperature Range: -55℃~+155℃
R96 R105 R108 R110 R115 = RC0603FR-0710KL: 电阻类型:厚膜电阻;阻值:10kΩ;精度:±1%;功率:100mW;; LCSC Part Name: 10kΩ ±1% 100mW; Supplier Part: C98220; Manufacturer: YAGEO(国巨); Supplier Footprint: 0603; JLCPCB Part Class: 扩展库; Datasheet: https://atta.szlcsc.com/upload/public/pdf/source/20170522/1495423494387.pdf; Supplier: LCSC; Type: 厚膜电阻; Tolerance: ±1%; Power(Watts): 100mW; Temperature Coefficient: ±100ppm/℃; Overload Voltage (Max): 75V; Operating Temperature Range: -55℃~+155℃
R49-R52 R66-R68 R71 R72 R106 = AC0603FR-0710RL: 电阻类型:厚膜电阻;阻值:10Ω;精度:±1%;功率:100mW;; LCSC Part Name: 10Ω ±1% 100mW; Supplier Part: C138286; Manufacturer: YAGEO(国巨); Supplier Footprint: 0603; JLCPCB Part Class: 扩展库; Datasheet: https://atta.szlcsc.com/upload/public/pdf/source/20171225/C138286_15141879483321202848.pdf; Supplier: LCSC; Type: 厚膜电阻; Tolerance: ±1%; Power(Watts): 100mW; Temperature Coefficient: ±200ppm/℃; Overload Voltage (Max): 75V; Operating Temperature Range: -55℃~+155℃
R56 R61 R95 R97 R107 = RC0603FR-07100KL: 电阻类型:厚膜电阻;阻值:100kΩ;精度:±1%;功率:100mW;温度系数:±100ppm/℃;; LCSC Part Name: 厚膜电阻 100kΩ ±1% 100mW; Supplier Part: C14675; Manufacturer: YAGEO(国巨); Supplier Footprint: 0603; JLCPCB Part Class: 扩展库; Datasheet: https://atta.szlcsc.com/upload/public/pdf/source/20140324/1457707028752.pdf; Supplier: LCSC; Type: 厚膜电阻; Tolerance: ±1%; Power(Watts): 100mW; Temperature Coefficient: ±100ppm/℃; Overload Voltage (Max): 75V; Operating Temperature Range: -55℃~+155℃
R94 R109 = 0603WAF1001T5E: 阻值:1kΩ;精度:±1%;功率:100mW;温度系数:±100ppm/℃;电阻类型:厚膜电阻;; LCSC Part Name: 1kΩ ±1% 100mW 厚膜电阻; Supplier Part: C21190; Manufacturer: UNI-ROYAL(厚声); Supplier Footprint: 0603; JLCPCB Part Class: Basic Part; Datasheet: https://atta.szlcsc.com/upload/public/pdf/source/20200306/C422600_1E6D84923E4A46A82E41ADD87F860B5C.pdf; Supplier: LCSC; Tolerance: ±1%; Power(Watts): 100mW; Overload Voltage (Max): 75V; Temperature Coefficient: ±100ppm/℃; Type: 厚膜电阻; Operating Temperature Range: -55℃~+155℃
R111 R114 = RC0603FR-071RL: 电阻类型:厚膜电阻;阻值:1Ω;精度:±1%;功率:100mW;最大工作电压:75V;温度系数:±200ppm/℃;; LCSC Part Name: 厚膜电阻 1Ω ±1% 100mW; Supplier Part: C112305; Manufacturer: YAGEO(国巨); Supplier Footprint: 0603; JLCPCB Part Class: Extended Part; Datasheet: https://atta.szlcsc.com/upload/public/pdf/source/20230412/AFDB764CF169FCD02397F47E2BB81F5A.pdf; Supplier: LCSC; Type: 厚膜电阻; Tolerance: ±1%; Power(Watts): 100mW; Overload Voltage (Max): 75V; Temperature Coefficient: ±200ppm/℃; Operating Temperature Range: -55℃~+155℃
R112 = 0603WAF200JT5E: 电阻类型:厚膜电阻;阻值:20Ω;精度:±1%;功率:100mW;最大工作电压:75V;温度系数:±100ppm/℃;; LCSC Part Name: 20Ω ±1% 100mW 厚膜电阻; Supplier Part: C22950; Manufacturer: UNI-ROYAL(厚声); Supplier Footprint: 0603; JLCPCB Part Class: Basic Part; Datasheet: https://atta.szlcsc.com/upload/public/pdf/source/20200306/C422600_1E6D84923E4A46A82E41ADD87F860B5C.pdf; Supplier: LCSC; Type: 厚膜电阻; Tolerance: ±1%; Power(Watts): 100mW; Overload Voltage (Max): 75V; Temperature Coefficient: ±100ppm/℃; Operating Temperature Range: -55℃~+155℃
R113 = MF52A103F3950 (A1): 阻值(25℃):10kΩ;B值(25℃/50℃):3950K;电阻精度:±1%;功率:50mW;B值精度:±1%;最大稳态电流(25℃):-;; LCSC Part Name: 10kΩ 电阻精度:±1% 3950K; Supplier Part: C13879; Manufacturer: 时恒; Supplier Footprint: 插件,P=1.7mm; JLCPCB Part Class: 扩展库; Datasheet: https://atta.szlcsc.com/upload/public/pdf/source/20181018/C324070_6015F64EA824A635FDB9BBFA1E1FD5FE.pdf; Supplier: LCSC; Resistance @ 25℃: 10kΩ; B Constant (25℃/50℃): 3950K; Resistance Tolerance: ±1%; Power: 50mW; B Constant Tolerance: ±1%; Operating Temperature: -55℃~+125℃
SW1 SW2 = TS-1101-C-W: 触点电流:50mA;额定电压(AC):-;额定电压(DC):12V;额定功率:-;绝缘电阻:-;电路结构:单刀单掷;安装方式:立贴;带灯:无;作用力:260gf;机械寿命:5万次;带支架:否;; LCSC Part Name: 立贴 6*3.6*2.5mm 轻触开关 一型3*6*2.5有白ZD b拉伸白色带淡绿按键 卷装; Supplier Part: C318938; Manufacturer: XKB Connectivity(中国星坤); Supplier Footprint: SMD; JLCPCB Part Class: 扩展库; Datasheet: https://atta.szlcsc.com/upload/public/pdf/source/20200227/C318938_C2E53B1EEDE37D980A33616AC086DE53.pdf; Supplier: LCSC; Contact Current: 50mA; Voltage Rating (DC): 12V; Circuit: 单刀单掷; Mounting Style: 立贴; Actuator Style: 矩形按钮; Actuator/Cap Color: 白色带淡绿; With Lamp: 无; Operating Force: 260gf; Mechanical Life: 5万次; Operating Temperature: -30℃~+85℃; Switch Length: 6mm; Switch Width: 3.6mm; Switch Height: 2.5mm; Strike Gundam: 否
C83 C84 = 0603B474K500NT: 容值:470nF;精度:±10%;额定电压:50V;材质(温度系数):X7R;; LCSC Part Name: 470nF ±10% 50V; Supplier Part: C77572; Manufacturer: FH(风华); Supplier Footprint: 0603; JLCPCB Part Class: Extended Part; Datasheet: https://atta.szlcsc.com/upload/public/pdf/source/20200305/C486355_26A10D38EF8C2A5C37091D0039909270.pdf; Supplier: LCSC; Tolerance: ±10%; Voltage Rated: 50V; Temperature Coefficient: X7R
C85-C87 = CC0603JRX7R9BB473: 容值:47nF;精度:±5%;额定电压:50V;材质(温度系数):X7R;; LCSC Part Name: 47nF ±5% 50V; Supplier Part: C519554; Manufacturer: YAGEO(国巨); Supplier Footprint: 0603; JLCPCB Part Class: Extended Part; Datasheet: https://atta.szlcsc.com/upload/public/pdf/source/20200423/C519554_A47B2077B76CCF5DDAED59412C429BD4.pdf; Supplier: LCSC; Tolerance: ±5%; Voltage Rated: 50V; Temperature Coefficient: X7R
R53 R55 R69 R70 = TC0325B3303T5F: 电阻类型:薄膜电阻;阻值:330kΩ;精度:±0.1%;功率:100mW;最大工作电压:75V;温度系数:±25ppm/℃;; LCSC Part Name: 330kΩ ±0.1% 100mW 薄膜电阻; Supplier Part: C2989388; Manufacturer: UNI-ROYAL(厚声); Supplier Footprint: 0603; JLCPCB Part Class: Extended Part; Datasheet: https://atta.szlcsc.com/upload/public/pdf/source/20220708/6ACD1707201702E70C0F417A19EB926E.pdf; Supplier: LCSC; Type: 薄膜电阻; Tolerance: ±0.1%; Power(Watts): 100mW; Overload Voltage (Max): 75V; Temperature Coefficient: ±25ppm/℃
R54 = 0603WAF3302T5E: 阻值:33kΩ;精度:±1%;功率:100mW;温度系数:±100ppm/℃;电阻类型:厚膜电阻;; LCSC Part Name: 33kΩ ±1% 100mW 厚膜电阻; Supplier Part: C4216; Manufacturer: UNI-ROYAL(厚声); Supplier Footprint: 0603; JLCPCB Part Class: Basic Part; Datasheet: https://atta.szlcsc.com/upload/public/pdf/source/20200306/C422600_1E6D84923E4A46A82E41ADD87F860B5C.pdf; Supplier: LCSC; Tolerance: ±1%; Power(Watts): 100mW; Overload Voltage (Max): 75V; Temperature Coefficient: ±100ppm/℃; Type: 厚膜电阻; Operating Temperature Range: -55℃~+155℃
R57 R60 R62 = PTFR0603B15K0P9: 电阻类型:薄膜电阻;阻值:15kΩ;精度:±0.1%;功率:100mW;最大工作电压:100V;温度系数:±25ppm/℃;; LCSC Part Name: 薄膜电阻 15kΩ ±0.1% 100mW; Supplier Part: C478879; Manufacturer: RESI(开步睿思）; Supplier Footprint: 0603; JLCPCB Part Class: 扩展库; Datasheet: https://atta.szlcsc.com/upload/public/pdf/source/20231020/37F75D505DFC5CA75CC16B0F0ECD8764.pdf; Supplier: LCSC; Type: 薄膜电阻; Tolerance: ±0.1%; Power(Watts): 100mW; Overload Voltage (Max): 100V; Temperature Coefficient: ±25ppm/℃; Operating Temperature Range: -55℃~+125℃
R58 = 0603WAF3004T5E: 电阻类型:厚膜电阻;阻值:3MΩ;精度:±1%;功率:100mW;最大工作电压:75V;温度系数:±100ppm/℃;; LCSC Part Name: 3MΩ ±1% 100mW 厚膜电阻; Supplier Part: C23156; Manufacturer: UNI-ROYAL(厚声); Supplier Footprint: 0603; JLCPCB Part Class: Extended Part; Datasheet: https://atta.szlcsc.com/upload/public/pdf/source/20200306/C422600_1E6D84923E4A46A82E41ADD87F860B5C.pdf; Supplier: LCSC; Type: 厚膜电阻; Tolerance: ±1%; Power(Watts): 100mW; Overload Voltage (Max): 75V; Temperature Coefficient: ±100ppm/℃; Operating Temperature Range: -55℃~+155℃
R59 = RT0603BRE07220KL: 电阻类型:薄膜电阻;阻值:220kΩ;精度:±0.1%;功率:100mW;最大工作电压:75V;温度系数:±50ppm/℃;; LCSC Part Name: 薄膜电阻 220kΩ ±0.1% 100mW; Supplier Part: C326764; Manufacturer: YAGEO(国巨); Supplier Footprint: 0603; JLCPCB Part Class: Extended Part; Datasheet: https://atta.szlcsc.com/upload/public/pdf/source/20181031/C326764_D76B712FE3A4847E5BBB2C2C7C178CED.pdf; Supplier: LCSC; Type: 薄膜电阻; Tolerance: ±0.1%; Power(Watts): 100mW; Overload Voltage (Max): 75V; Temperature Coefficient: ±50ppm/℃; Operating Temperature Range: -55℃~+155℃
C110-C113 C116-C119 C121 = CC0603KRX7R9BB104: 容值:100nF;精度:±10%;额定电压:50V;材质(温度系数):X7R;; LCSC Part Name: 100nF ±10% 50V; Supplier Part: C14663; Manufacturer: YAGEO(国巨); Supplier Footprint: 0603; JLCPCB Part Class: Basic Part; Datasheet: https://atta.szlcsc.com/upload/public/pdf/source/20180910/C282072_33301C7F631E79921B82A8DAC6BCC5B3.pdf; Supplier: LCSC; Tolerance: ±10%; Voltage Rated: 50V; Temperature Coefficient: X7R
C114 C115 = CC0603JRNPO9BN200: 容值:20pF;精度:±5%;额定电压:50V;材质(温度系数):NP0;; LCSC Part Name: 20pF ±5% 50V; Supplier Part: C105621; Manufacturer: YAGEO(国巨); Supplier Footprint: 0603; JLCPCB Part Class: Extended Part; Datasheet: https://atta.szlcsc.com/upload/public/pdf/source/20170505/1493957838062.pdf; Supplier: LCSC; Tolerance: ±5%; Voltage Rated: 50V; Temperature Coefficient: NP0
CN4 = GH1.25-4P立贴-USART: 插针结构:1x4P;间距:1.25mm;安装方式:卧贴;参考系列:GH;总PIN数:4P;排数:1;每排PIN数:4;额定电流:1A;工作温度范围:-25℃~+85℃;; LCSC Part Name: 1x4P 间距:1.25mm 卧贴 系列:GH; Supplier Part: C3029379; Manufacturer: XUNPU(讯普); Supplier Footprint: SMD,P=1.25mm,卧贴; JLCPCB Part Class: 扩展库; Datasheet: https://atta.szlcsc.com/upload/public/pdf/source/20220527/CB8773BFB0913C3B8ABD62CB38BA101A.pdf; Supplier: LCSC; Pins Structure: 1x4P; Pitch: 1.25mm; Mounting Style: 卧贴; Reference Series: GH; Number of Pins: 4P; Number of Rows: 1; Number of PINs Per Row: 4; Current Rating (Max): 1A; Operating Temperature Range: -25℃~+85℃
CN5 = GH1.25-2P立贴: 插针结构:1x2P;间距:1.25mm;安装方式:立贴;参考系列:GH;总PIN数:2P;排数:1;每排PIN数:2;额定电流:1A;工作温度范围:-25℃~+85℃;; LCSC Part Name: 1x2P 间距:1.25mm 立贴 系列:GH; Supplier Part: C3029368; Manufacturer: XUNPU(讯普); Supplier Footprint: SMD,P=1.25mm; JLCPCB Part Class: 扩展库; Datasheet: https://atta.szlcsc.com/upload/public/pdf/source/20220527/44F824AAC8C2B617205E15955FF9C23D.pdf; Supplier: LCSC; Pins Structure: 1x2P; Pitch: 1.25mm; Mounting Style: 立贴; Reference Series: GH; Number of Pins: 2P; Number of Rows: 1; Number of PINs Per Row: 2; Current Rating (Max): 1A; Operating Temperature Range: -25℃~+85℃
CN6 CN7 = GH1.25-3P立贴: 插针结构:1x3P;间距:1.25mm;安装方式:立贴;参考系列:GH;总PIN数:3P;排数:1;每排PIN数:3;额定电流:1A;工作温度范围:-25℃~+85℃;; LCSC Part Name: 1x3P 间距:1.25mm 立贴 系列:GH; Supplier Part: C3029369; Manufacturer: XUNPU(讯普); Supplier Footprint: SMD,P=1.25mm; JLCPCB Part Class: 扩展库; Datasheet: https://atta.szlcsc.com/upload/public/pdf/source/20220527/44F824AAC8C2B617205E15955FF9C23D.pdf; Supplier: LCSC; Pins Structure: 1x3P; Pitch: 1.25mm; Mounting Style: 立贴; Reference Series: GH; Number of Pins: 3P; Number of Rows: 1; Number of PINs Per Row: 3; Current Rating (Max): 1A; Operating Temperature Range: -25℃~+85℃
CN8 = 532610471: 插针结构:1x4P;间距:1.25mm;安装方式:-;行距:-;排数:1;每排PIN数:4;参考系列:-;触头材质:青铜;; LCSC Part Name: 间距:1.25mm 1x4P; Supplier Part: C240847; Manufacturer: MOLEX; Supplier Footprint: SMD,P=1.25mm; JLCPCB Part Class: 扩展库; Datasheet: https://atta.szlcsc.com/upload/public/pdf/source/20180801/C240848_05185111BCEC053393D7785380F62CFD.pdf; Supplier: LCSC; Pins Structure: 1x4P; Pitch: 1.25mm; Number of Rows: 1; Number of PINs Per Row: 4; Contact Material: 青铜
D17 = SMAJ5.0CA/TR13: 极性:双向;反向截止电压(Vrwm):5V;击穿电压(最小值):6.4V;击穿电压(最大值):7V;反向漏电流(Ir):800uA;峰值脉冲电流(Ipp)@10/1000μs:43.5A;最大钳位电压:9.2V;; LCSC Part Name: 双向 Vrwm:5V; Supplier Part: C78402; Manufacturer: Brightking(君耀电子); Supplier Footprint: SMA(DO-214AC); JLCPCB Part Class: 扩展库; Datasheet: https://atta.szlcsc.com/upload/public/pdf/source/20160709/1468031881739.pdf; Supplier: LCSC; Polarity: 双向; Reverse Stand-Off Voltage (Vrwm): 5V; Breakdown Voltage (Min): 6.4V; Breakdown Voltage (Max): 7V; Reverse Leakage Current (Ir): 800uA; Peak Pulse Current (Ipp)@10/1000μs: 43.5A; Maximum Clamping Voltage: 9.2V
R92 = Res_0603: Supplier Footprint: 0603; Check: false
R93 = 0603WAF1200T5E: 阻值:120Ω;精度:±1%;功率:100mW;温度系数:±100ppm/℃;电阻类型:厚膜电阻;; LCSC Part Name: 120Ω ±1% 100mW 厚膜电阻; Supplier Part: C22787; Manufacturer: UNI-ROYAL(厚声); Supplier Footprint: 0603; JLCPCB Part Class: 基础库; Datasheet: https://atta.szlcsc.com/upload/public/pdf/source/20200306/C422600_1E6D84923E4A46A82E41ADD87F860B5C.pdf; Supplier: LCSC; Tolerance: ±1%; Power(Watts): 100mW; Overload Voltage (Max): 75V; Temperature Coefficient: ±100ppm/℃; Type: 厚膜电阻; Operating Temperature Range: -55℃~+155℃
R98 = 0402WGF0000TCE: 电阻类型:厚膜电阻;阻值:0Ω;精度:±1%;功率:62.5mW;最大工作电压:50V;温度系数:±800ppm/℃;; LCSC Part Name: 0Ω ±1% 62.5mW 厚膜电阻; Supplier Part: C17168; Manufacturer: UNI-ROYAL(厚声); Supplier Footprint: 0402; JLCPCB Part Class: Basic Part; Datasheet: https://atta.szlcsc.com/upload/public/pdf/source/20200306/C422600_1E6D84923E4A46A82E41ADD87F860B5C.pdf; Supplier: LCSC; Type: 厚膜电阻; Tolerance: ±1%; Power(Watts): 62.5mW; Overload Voltage (Max): 50V; Temperature Coefficient: ±800ppm/℃; Operating Temperature Range: -55℃~+155℃
R99 R100 = RC0603FR-07100RL: 电阻类型:厚膜电阻;阻值:100Ω;精度:±1%;功率:100mW;; LCSC Part Name: 100Ω ±1% 100mW; Supplier Part: C105588; Manufacturer: YAGEO(国巨); Supplier Footprint: 0603; JLCPCB Part Class: 扩展库; Datasheet: https://atta.szlcsc.com/upload/public/pdf/source/20170428/1493376742308.pdf; Supplier: LCSC; Type: 厚膜电阻; Tolerance: ±1%; Power(Watts): 100mW; Temperature Coefficient: ±100ppm/℃; Overload Voltage (Max): 75V; Operating Temperature Range: -55℃~+155℃
U13 = ZD25WQ16CEIGR: 接口类型:SPI;存储容量:16Mbit;时钟频率(fc):104MHz;; Supplier Part: C7304007; Manufacturer: Zetta(澜智); Supplier Footprint: USON-8(2x3); JLCPCB Part Class: Extended Part; Datasheet: https://atta.szlcsc.com/upload/public/pdf/source/20230227/377F8688CFA586E30BAF3C1DACB7B6CC.pdf; Supplier: LCSC; Interface Type: SPI; Memory Size: 16Mbit; Clock Frequency (fc): 104MHz; Supply Voltage: 1.65V~3.6V; Supply Current (Read): 2.8mA; Supply Current (Program): 5mA; Supply Current (Erase): 5mA; Standby supply current: 12uA; Page Programming Time (Tpp): 2ms; Block Erase Time (tBE): 10ms; Data Retention - TDR (Year): 20年; Operating Temperature: -40℃~+85℃
U14 = SIT1050TK: 类型:收发器;数据速率:1Mbps;; LCSC Part Name: 1Mbps 4.5V~5.5V; Supplier Part: C427444; Manufacturer: SIT(芯力特); Supplier Footprint: TDFN-8-EP(3x3); JLCPCB Part Class: 扩展库; Datasheet: https://atta.szlcsc.com/upload/public/pdf/source/20190918/C427444_45D8B7A35B400FE4558CE3481D87E254.pdf; Supplier: LCSC; Type: 收发器; Data Rate: 1Mbps; Supply Voltage: 4.5V~5.5V
U15 = STM32F103C8T6: CPU内核:ARM Cortex-M3;CPU最大主频:72MHz;程序存储容量:64KB;程序存储器类型:FLASH;RAM总容量:20KB;GPIO端口数量:37;ADC(位数):12bit;工作温度范围:-40℃~+85℃;; LCSC Part Name: ARM Cortex-M3 72MHz MSL=3; Supplier Part: C8734; Manufacturer: ST(意法半导体); Supplier Footprint: LQFP-48(7x7); JLCPCB Part Class: 扩展库; Datasheet: https://atta.szlcsc.com/upload/public/pdf/source/20220812/8363ACEC51AD55ECEB84799464F7CB85.pdf; Supplier: LCSC; CPU Core: ARM Cortex-M3; CPU Maximum Speed: 72MHz; Operating Voltage Range: 2V~3.6V; Program Storage Size: 64KB; Program Memory Type: FLASH; RAM Size: 20KB; EEPROM: 64KB; GPIO Ports Number: 37; ADC (Bit): 12bit; Peripheral/Function: 看门狗；DMA；看门狗；片载温度传感器; Internal Oscillator: 有; Operating Temperature Range: -40℃~+85℃
U16 = XL-0807RGBC-WS2812B: 发光颜色:RGB三色;二极管配置:-;主波长:-;色温:-;光通量(25℃时):-;发光强度:-;功率:-;安装方式:正贴;; LCSC Part Name: RGB三色 正贴; Supplier Part: C3646929; Manufacturer: XINGLIGHT(成兴光); Supplier Footprint: SMD,1.8x2mm; JLCPCB Part Class: Extended Part; Datasheet: https://atta.szlcsc.com/upload/public/pdf/source/20220704/8AC05C59AC3A71CCA97D1D2180172B1A.pdf; Supplier: LCSC; Emitted Color: RGB三色; Lens Color: 透明; Forward Current: 20mA; Forward Voltage (VF): 3.5V~5.5V; Viewing Angle: 120°; Mounting Sytle: 正贴; Operating Temperature: -40℃~+150℃
X1 = XL2EL89COI-111YLC-8M: 频率:8MHz;负载电容:12pF;频率公差:±10ppm;; LCSC Part Name: 8MHz ±10ppm 12pF YSX321SL; Supplier Part: C2973805; Manufacturer: YXC(扬兴晶振); Supplier Footprint: SMD3225-4P; JLCPCB Part Class: 扩展库; Datasheet: https://atta.szlcsc.com/upload/public/pdf/source/20220125/852C32DDA5BD01FF6A100E3BD98B4C83.pdf; Supplier: LCSC; Crystal Type: 贴片无源晶振; Load Capacitance: 12pF; Equivalent Series Resistance (ESR): 150Ω; Frequency Tolerance: ±10ppm; Frequency Stability: ±30ppm; Operating Temperature: -40℃~+85℃
U7-U9 = INA240A2PWR: 通道数:1;; Supplier Part: C129949; Manufacturer: TI(德州仪器); Supplier Footprint: TSSOP-8; JLCPCB Part Class: Extended Part; Datasheet: https://www.ti.com/cn/lit/gpn/ina240; Supplier: LCSC; Number of Channels: 1; Supply Current: 1.8mA; Operating Temperature: -40℃~+125℃

## Nets
+5V: C118.1 C119.1 C120.1 U14.3(VCC) U16.1(VDD) ; also on sheet 1
AGND: BUZZER1.3 C78.1 C79.2 C80.2 C82.1 C85.1 C86.1 C87.1 C88.2 C89.2 C90.2 C91.2 C92.2 C93.2 C94.1 C95.2 C96.1 C97.2 C98.1 C99.1 C100.1 C101.1 C102.1 C103.1 C104.1 C105.2 C106.2 C107.1 C108.1 C109.1 C110.1 C111.1 C112.1 C113.1 C114.2 C115.2 C116.1 C117.1 C118.2 C119.2 C120.2 C121.2 C122.1 C123.1 C124.1 C125.1 C126.2 C128.2 C129.1 CN4.2(GND) CN4.5 CN4.6 CN5.3 CN5.4 CN6.3(GND) CN6.4 CN6.5 CN7.3(GND) CN7.4 CN7.5 CN8.3 CN8.5 CN8.6 D17.1(K) Q19.2(S) Q20.2(S) Q21.2(S) R50.2 R60.1 R61.2 R62.1 R63.1 R64.1 R65.1 R73.1 R74.1 R80.1 R81.1 R83.1 R84.1 R85.1 R86.1 R90.1 R95.2 R97.1 R98.1 R107.2 R108.2 R110.1 R115.1 R116.1 RN4.6 RN5.7 RN7.6 SW1.2 U7.1(NC) U7.4(GND) U7.7(REF1) U8.1(NC) U8.4(GND) U8.7(REF1) U9.1(NC) U9.4(GND) U9.7(REF1) U13.4(VSS) U13.9(EP) U14.2(GND) U14.8(S) U14.9(EP) U15.8(VSSA) U15.23(VSS_1) U15.35(VSS_2) U15.47(VSS_3) U16.3(GND) U17.12(IMON_INN) U18.11(V-) U18.17(EP) U19.11(V-) U19.17(EP) U20.11(V-) U20.17(EP) X1.2(GND) X1.4(GND) ; also on sheet 1 2 3
AVCC: C111.2 C124.2 R75.2 R76.2 R77.2 R87.2 R109.1 R113.2 U4.2 U5.2 U6.2 U10.2 U11.2 U12.2 U15.9(VDDA) ; also on sheet 1
VCC: C110.2 C112.2 C113.2 C116.2 C117.2 C122.2 C123.2 C125.2 C128.1 C129.2 C130.2 CN8.4 D17.2(A) D19.1(K) LED6.2(A) R96.2 R112.1 U13.7(HOLD#/IO3) U13.8(VCC) U15.1(VBAT) U15.24(VDD_1) U15.36(VDD_2) U15.48(VDD_3) ; also on sheet 1
VIN: C78.2 C83.1 U7.3(IN-) U9.3(IN-) U17.32(CSNIN) ; also on sheet 1 3
VINHIMON: R57.1 U17.27(VINHIMON)
6.7: C126.1 Q18.2(S) R103.1 ; also on sheet 1
ADC1_4: R71.1 U15.14(PA4)
ADC1_5: R72.1 U15.15(PA5)
ADC1_6: R66.1 U15.16(PA6)
ADC1_7: R67.1 U15.17(PA7)
ADC1_8: R68.1 U15.18(PB0)
ADC1_9: R113.1 R116.2 U15.19(PB1)
BOOT0: R95.1 U15.44(BOOT0)
BOOT1: R97.2 U15.20(PB2)
BUZZER: R114.1 U15.32(PA11)
CAN+: CN5.1(CANH) R93.2 U14.7(CANH)
CAN-: CN5.2(CANL) R93.1 U14.6(CANL)
CAN_RX: U14.4(RXD) U15.45(PB8)
CAN_TX: U14.1(TXD) U15.46(PB9)
CAP: C79.1 C84.2 LED7.2(A) R54.2 R55.2 R70.2 R101.2 R102.2 U8.3(IN-) U17.31(CSNOUT) ; also on sheet 1 3
CAP_RELEASE: Q19.1(G) R107.1 SW2.2 U15.27(PB14)
CELL: R51.2 R53.2 R69.2 U7.2(IN+) ; also on sheet 3
CHASSIS: U9.2(IN+) ; also on sheet 3
CLKOUT: U15.42(PB6) ; also on sheet 2
CS+: R49.2 ; also on sheet 3
CS_FLASH: U13.1(CS#) U15.38(PA15)
CSN: C81.1 C82.2 R50.1 U17.4(CSN)
CSOUT+: R52.2 R98.2 U8.2(IN+) ; also on sheet 3
CSP: C80.1 C81.2 R49.1 U17.5(CSP)
CSPIN: C83.2 R51.1 U17.33(CSPIN)
CSPOUT: C84.1 R52.1 U17.30(CSPOUT)
DAC_FBOUT: R59.2 U19.13(IN4-) U19.14(OUT4)
DAC_IMON_INP: RN7.7 U19.15(OUT1) U19.16(IN1-)
DAC_IMON_ON: RN5.6 U19.8(OUT3) U19.9(IN3-)
DAC_IMON_OP: RN4.7 U19.4(IN2-) U19.5(OUT2)
FAN: R111.1 U15.29(PA8)
FBIN: R56.1 U17.8(FBIN)
FBOUT: R55.1 R59.1 R62.2 U17.9(FBOUT)
IMON_INP: C85.2 R63.2 R91.2 U17.11(IMON_INP) U18.12(IN4+)
IMON_ON: C86.2 R64.2 R89.2 U17.39(IMON_ON) U20.12(IN4+)
IMON_OP: C87.2 R65.2 R88.2 U17.38(IMON_OP) U20.10(IN3+)
LDO33: R56.2 ; also on sheet 2
LED_DATA: U15.43(PB7) U16.4(DIN)
NRST: C121.1 R96.1 SW1.1 U15.7(NRST)
OSCIN: C114.1 R92.2 U15.5(PD0-OSC_IN) X1.3
OSCOUT: C115.1 R92.1 U15.6(PD1-OSC_OUT) X1.1
OVER_I_IRQ: R105.2 R108.1 U15.28(PB15)
PWM_FBOUT: R87.1 R90.2 RN6.4 U15.11(PA1)
PWM_IMON_INP: R75.1 R80.2 RN1.4 U15.10(PA0-WKUP)
PWM_IMON_ON: R77.1 R85.2 RN3.4 U15.22(PB11)
PWM_IMON_OP: R76.1 R81.2 RN2.4 U15.21(PB10)
RVSOFF: U15.26(PB13) ; also on sheet 2
SPI1_CLK: U13.6(SCLK) U15.39(PB3)
SPI1_MISO: U13.2(SO/IO1) U15.40(PB4)
SPI1_MOSI: U13.5(SI/IO0) U15.41(PB5)
SWDCLK: R99.1 U15.37(PA14)
SWDIO: R100.1 U15.34(PA13)
SWEN: U15.25(PB12) ; also on sheet 2
USART1_RX: CN6.2(TXD) CN7.2(TXD) U15.31(PA10)
USART1_TX: CN6.1(RXD) CN7.1(RXD) U15.30(PA9)
USART2_RX: CN4.4(RXD) U15.13(PA3)
USART2_TX: CN4.3(TXD) U15.12(PA2)
VOUTLOMON: R58.1 U17.26(VOUTLOMON)
WP: U13.3(WP#/IO2) U15.33(PA12)
$4N1288: R54.1 R58.2 R61.1
$4N1291: R53.1 R57.2 R60.2
$5N884: C89.1 U5.1 U8.5(VS) U8.6(REF2)
$5N885: C88.1 U4.1 U7.5(VS) U7.6(REF2)
$5N888: R69.1 R73.2 U18.3(IN2+)
$5N890: R70.1 R74.2 U18.1(IN1+)
$5N899: R71.2 U18.4(IN2-) U18.5(OUT2)
$5N900: R72.2 U18.15(OUT1) U18.16(IN1-)
$5N3070: C90.1 U6.1 U9.5(VS) U9.6(REF2)
$5N4497: R66.2 U7.8(OUT)
$5N4536: R67.2 U8.8(OUT)
$5N4575: R68.2 U9.8(OUT)
$5N9158: C91.1 U10.1 U18.2(V+)
$6N8297: C92.1 U11.1 U19.2(V+)
$6N8599: C105.1 U12.1 U20.2(V+)
$6N9250: R78.2 R83.2 U19.1(IN1+)
$6N9251: C99.2 RN1.5 RN1.6
$6N9252: C93.1 RN1.2 RN1.3
$6N9253: C100.2 RN1.7 RN1.8
$6N9256: C94.2 R78.1 RN1.1
$6N9669: C101.2 RN2.5 RN2.6
$6N9670: C95.1 RN2.2 RN2.3
$6N9671: C102.2 RN2.7 RN2.8
$6N9674: C96.2 R79.1 RN2.1
$6N9686: R79.2 R84.2 U19.3(IN2+)
$6N10101: C103.2 RN3.5 RN3.6
$6N10102: C97.1 RN3.2 RN3.3
$6N10103: C104.2 RN3.7 RN3.8
$6N10106: C98.2 R82.1 RN3.1
$6N10110: R82.2 R86.2 U19.10(IN3+)
$6N10522: C108.2 RN6.5 RN6.6
$6N10523: C106.1 RN6.2 RN6.3
$6N10524: C109.2 RN6.7 RN6.8
$6N10527: C107.2 RN6.1 U19.12(IN4+)
$6N10919: RN5.3 RN5.4 U20.1(IN1+)
$6N10920: RN5.5 U20.13(IN4-) U20.14(OUT4)
$6N10921: R89.1 RN5.8 U20.15(OUT1)
$6N10922: RN5.1 RN5.2 U20.16(IN1-)
$6N11254: RN4.1 RN4.2 U20.3(IN2+)
$6N11255: RN4.8 U20.8(OUT3) U20.9(IN3-)
$6N11256: R88.1 RN4.5 U20.5(OUT2)
$6N11257: RN4.3 RN4.4 U20.4(IN2-)
$6N11586: RN7.8 U18.13(IN4-) U18.14(OUT4)
$6N11587: R91.1 RN7.5 U18.8(OUT3)
$6N22785: RN7.3 RN7.4 U18.9(IN3-)
$6N22787: RN7.1 RN7.2 U18.10(IN3+)
$7N7917: CN8.1 R100.2
$7N7918: CN8.2 R99.2
$7N8012: R94.1 U15.2(PC13-TAMPER-RTC)
$7N8013: LED6.1(K) R94.2
$8N1618: BUZZER1.2 C130.1 D19.2(A) Q21.3(D)
$8N1620: Q21.1(G) R114.2 R115.2
$8N1660: Q19.3(D) R101.1 R102.1 R104.1
$8N1661: R109.2 SW2.1
$8N1663: C127.1 R106.1
$8N5269: BUZZER1.1 R112.2
$8N7591: C127.2 CN9.2 D18.2(A) Q20.3(D)
$8N9095: CN9.1 D18.1(K) Q18.1(G) R103.2 R106.2
$8N9469: Q20.1(G) R110.2 R111.2
$8N9536: Q18.3(D) R105.1
$8N21990: LED7.1(K) R104.2

Not connected (* = marked no-connect by the designer): CN4 1(+5V)*; U14 5(Vref)*; U15 3(PC14-OSC32_IN)* 4(PC15-OSC32_OUT)*; U16 2(DOUT)*; U18 6(NC)* 7(NC)*; U19 6(NC)* 7(NC)*; U20 6(NC)* 7(NC)*

## Notes on the sheets
sheet 4
- 11S（29.15V）
sheet 6
- 输入45W，充放电20A，26.2V
sheet 7
- 存储
- 串口
- 系统板
- UART1
- CAN
- 未反接
- 监听
- LED
- REST
- SPI1
- UART3
- 裁判串口（已反接）
- SWD
- 校准焊盘
- 去耦
sheet 8
- 过压保护
- 散热电机
- 蜂鸣器
- 测温
- 10KR-320R (24-124)
- 0.55-2.84
